# EAGLE design CrackberryPi_1.0.6.2 (EAGLE 7.2.0)
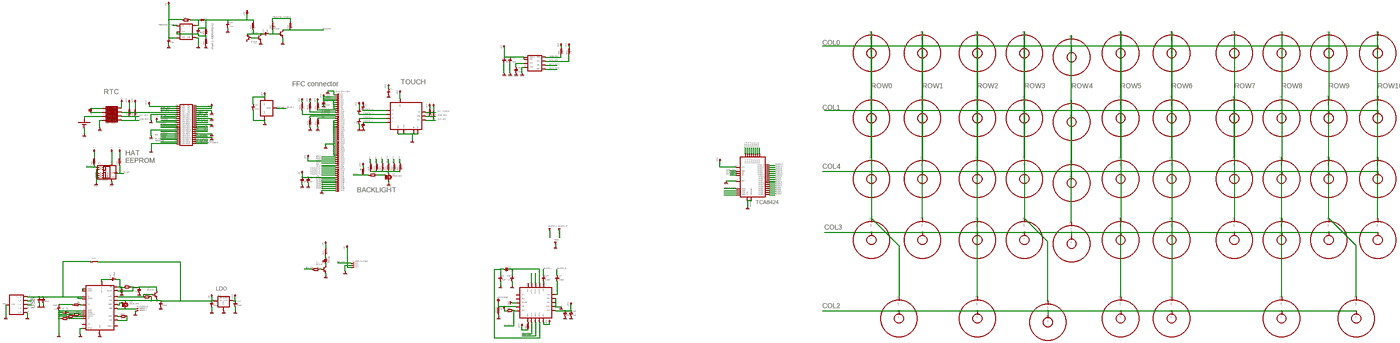
[diagram p0: schematic, sheet 1, overview]
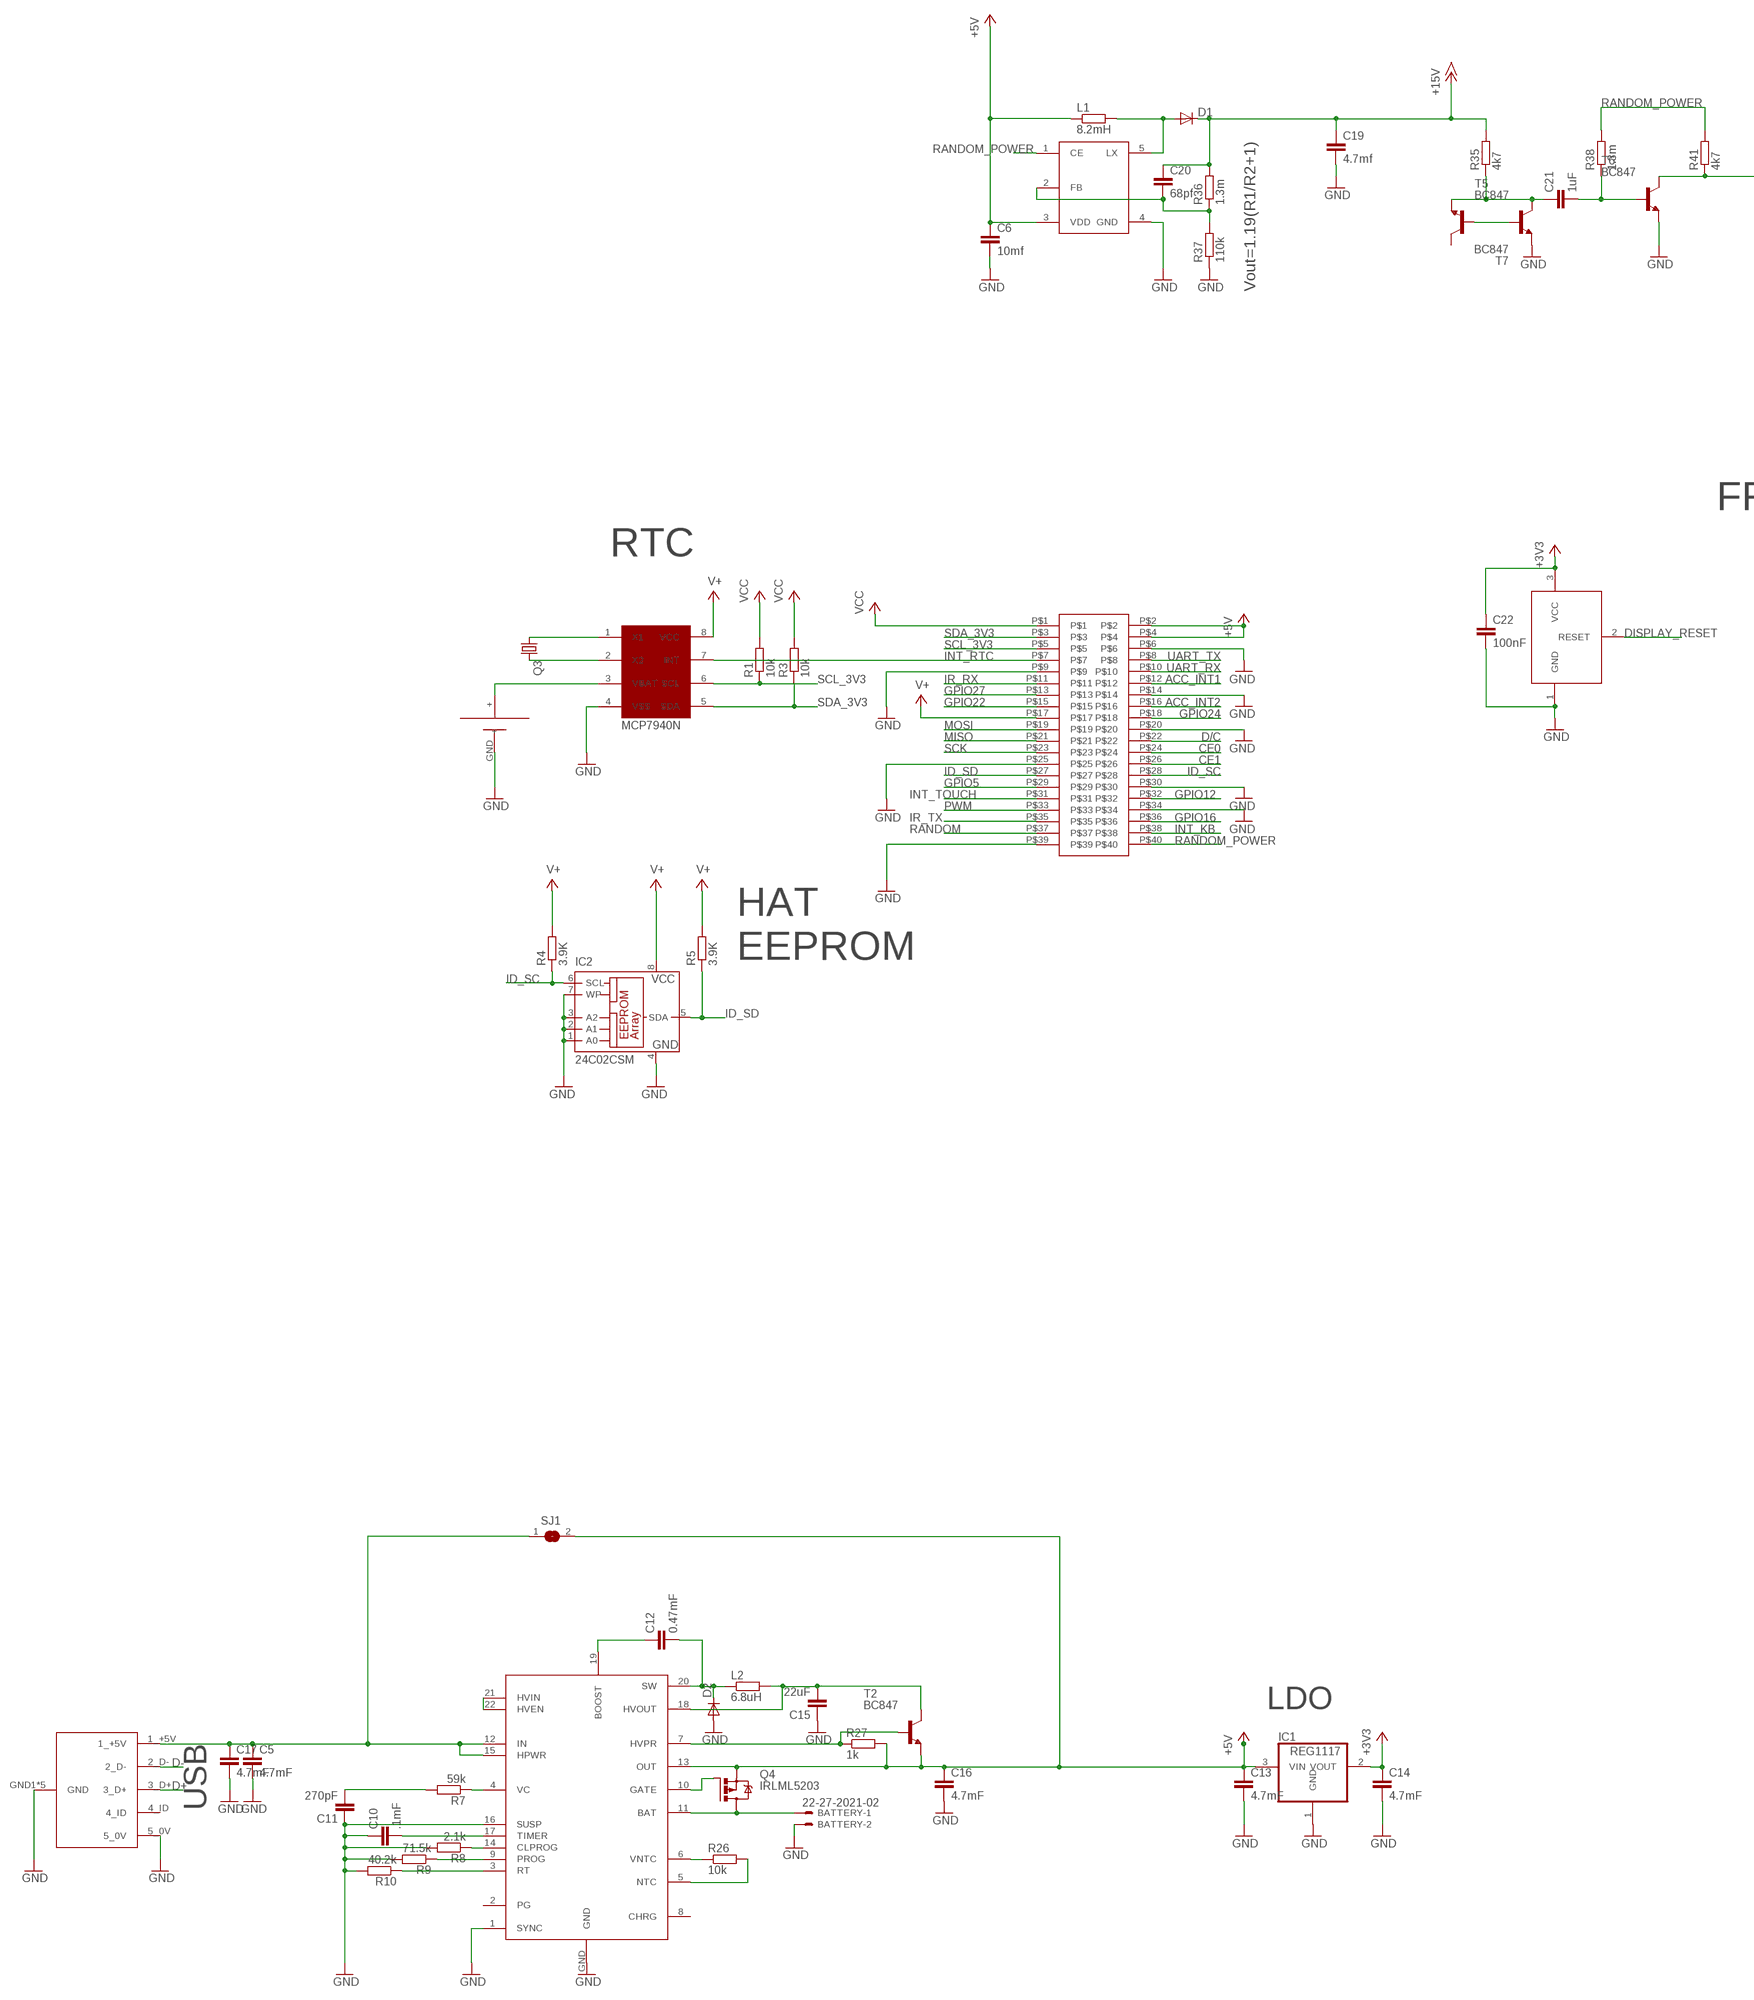
[diagram p1: schematic, sheet 1, part 1 of 4]
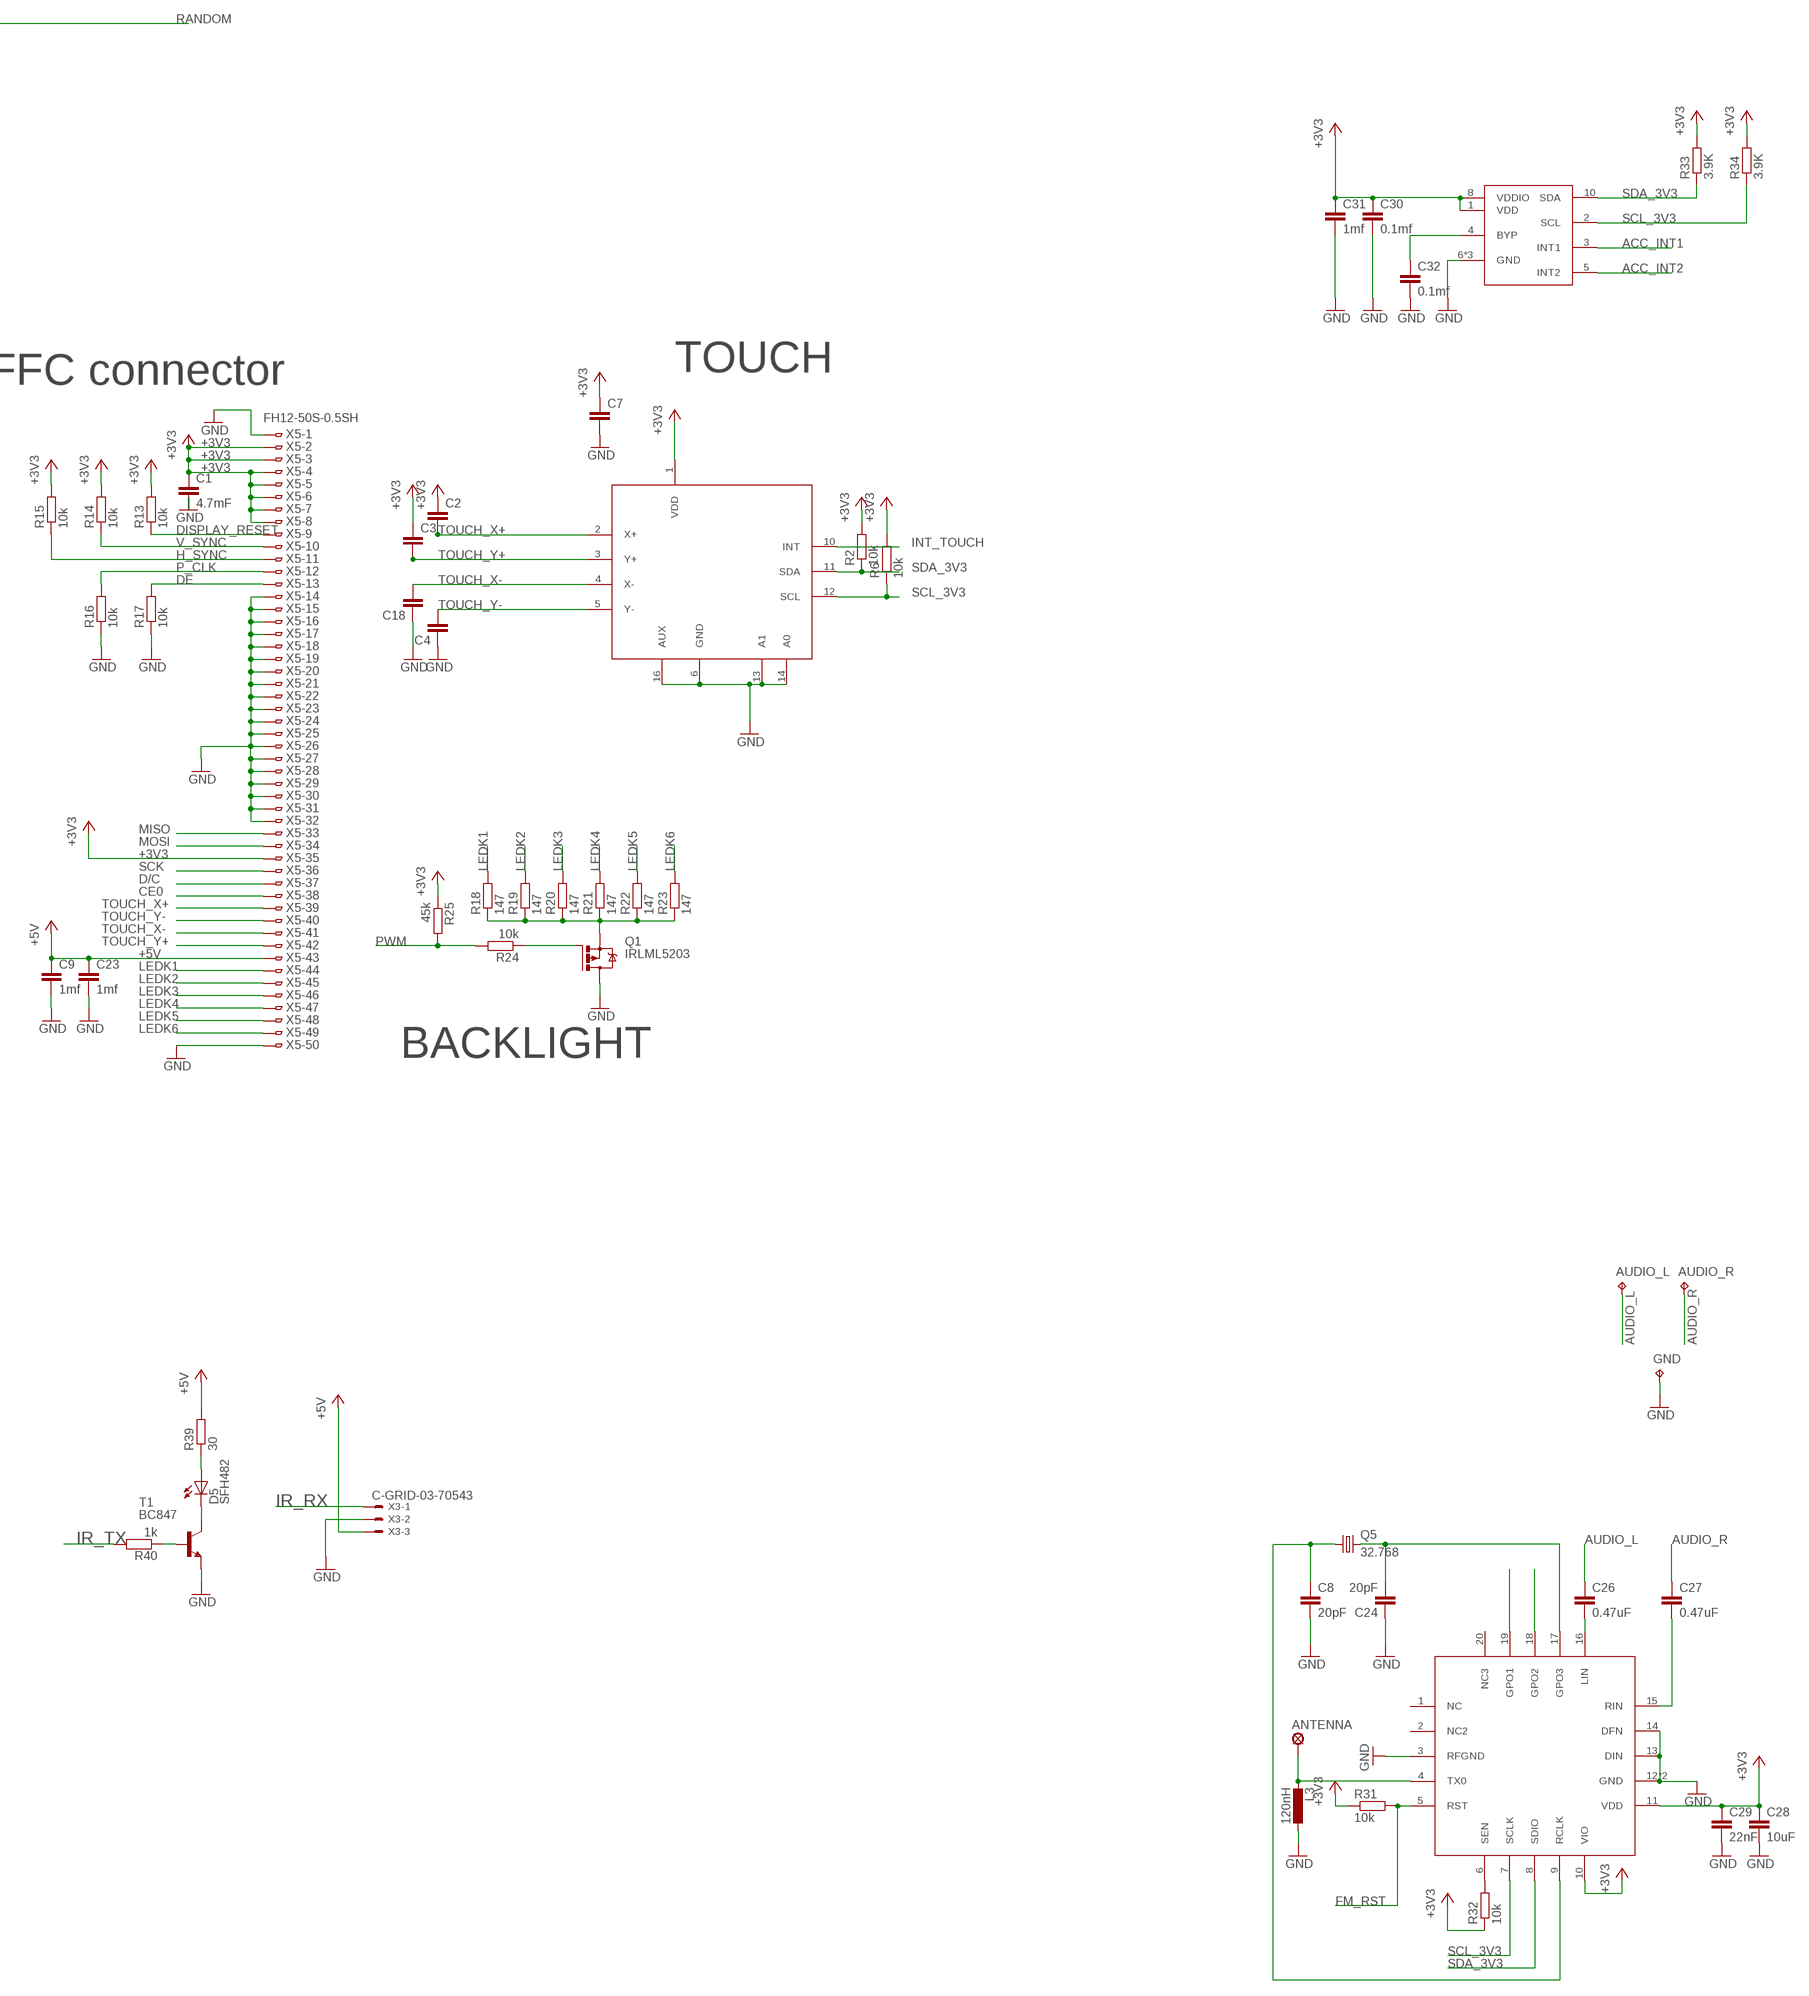
[diagram p2: schematic, sheet 1, part 2 of 4]
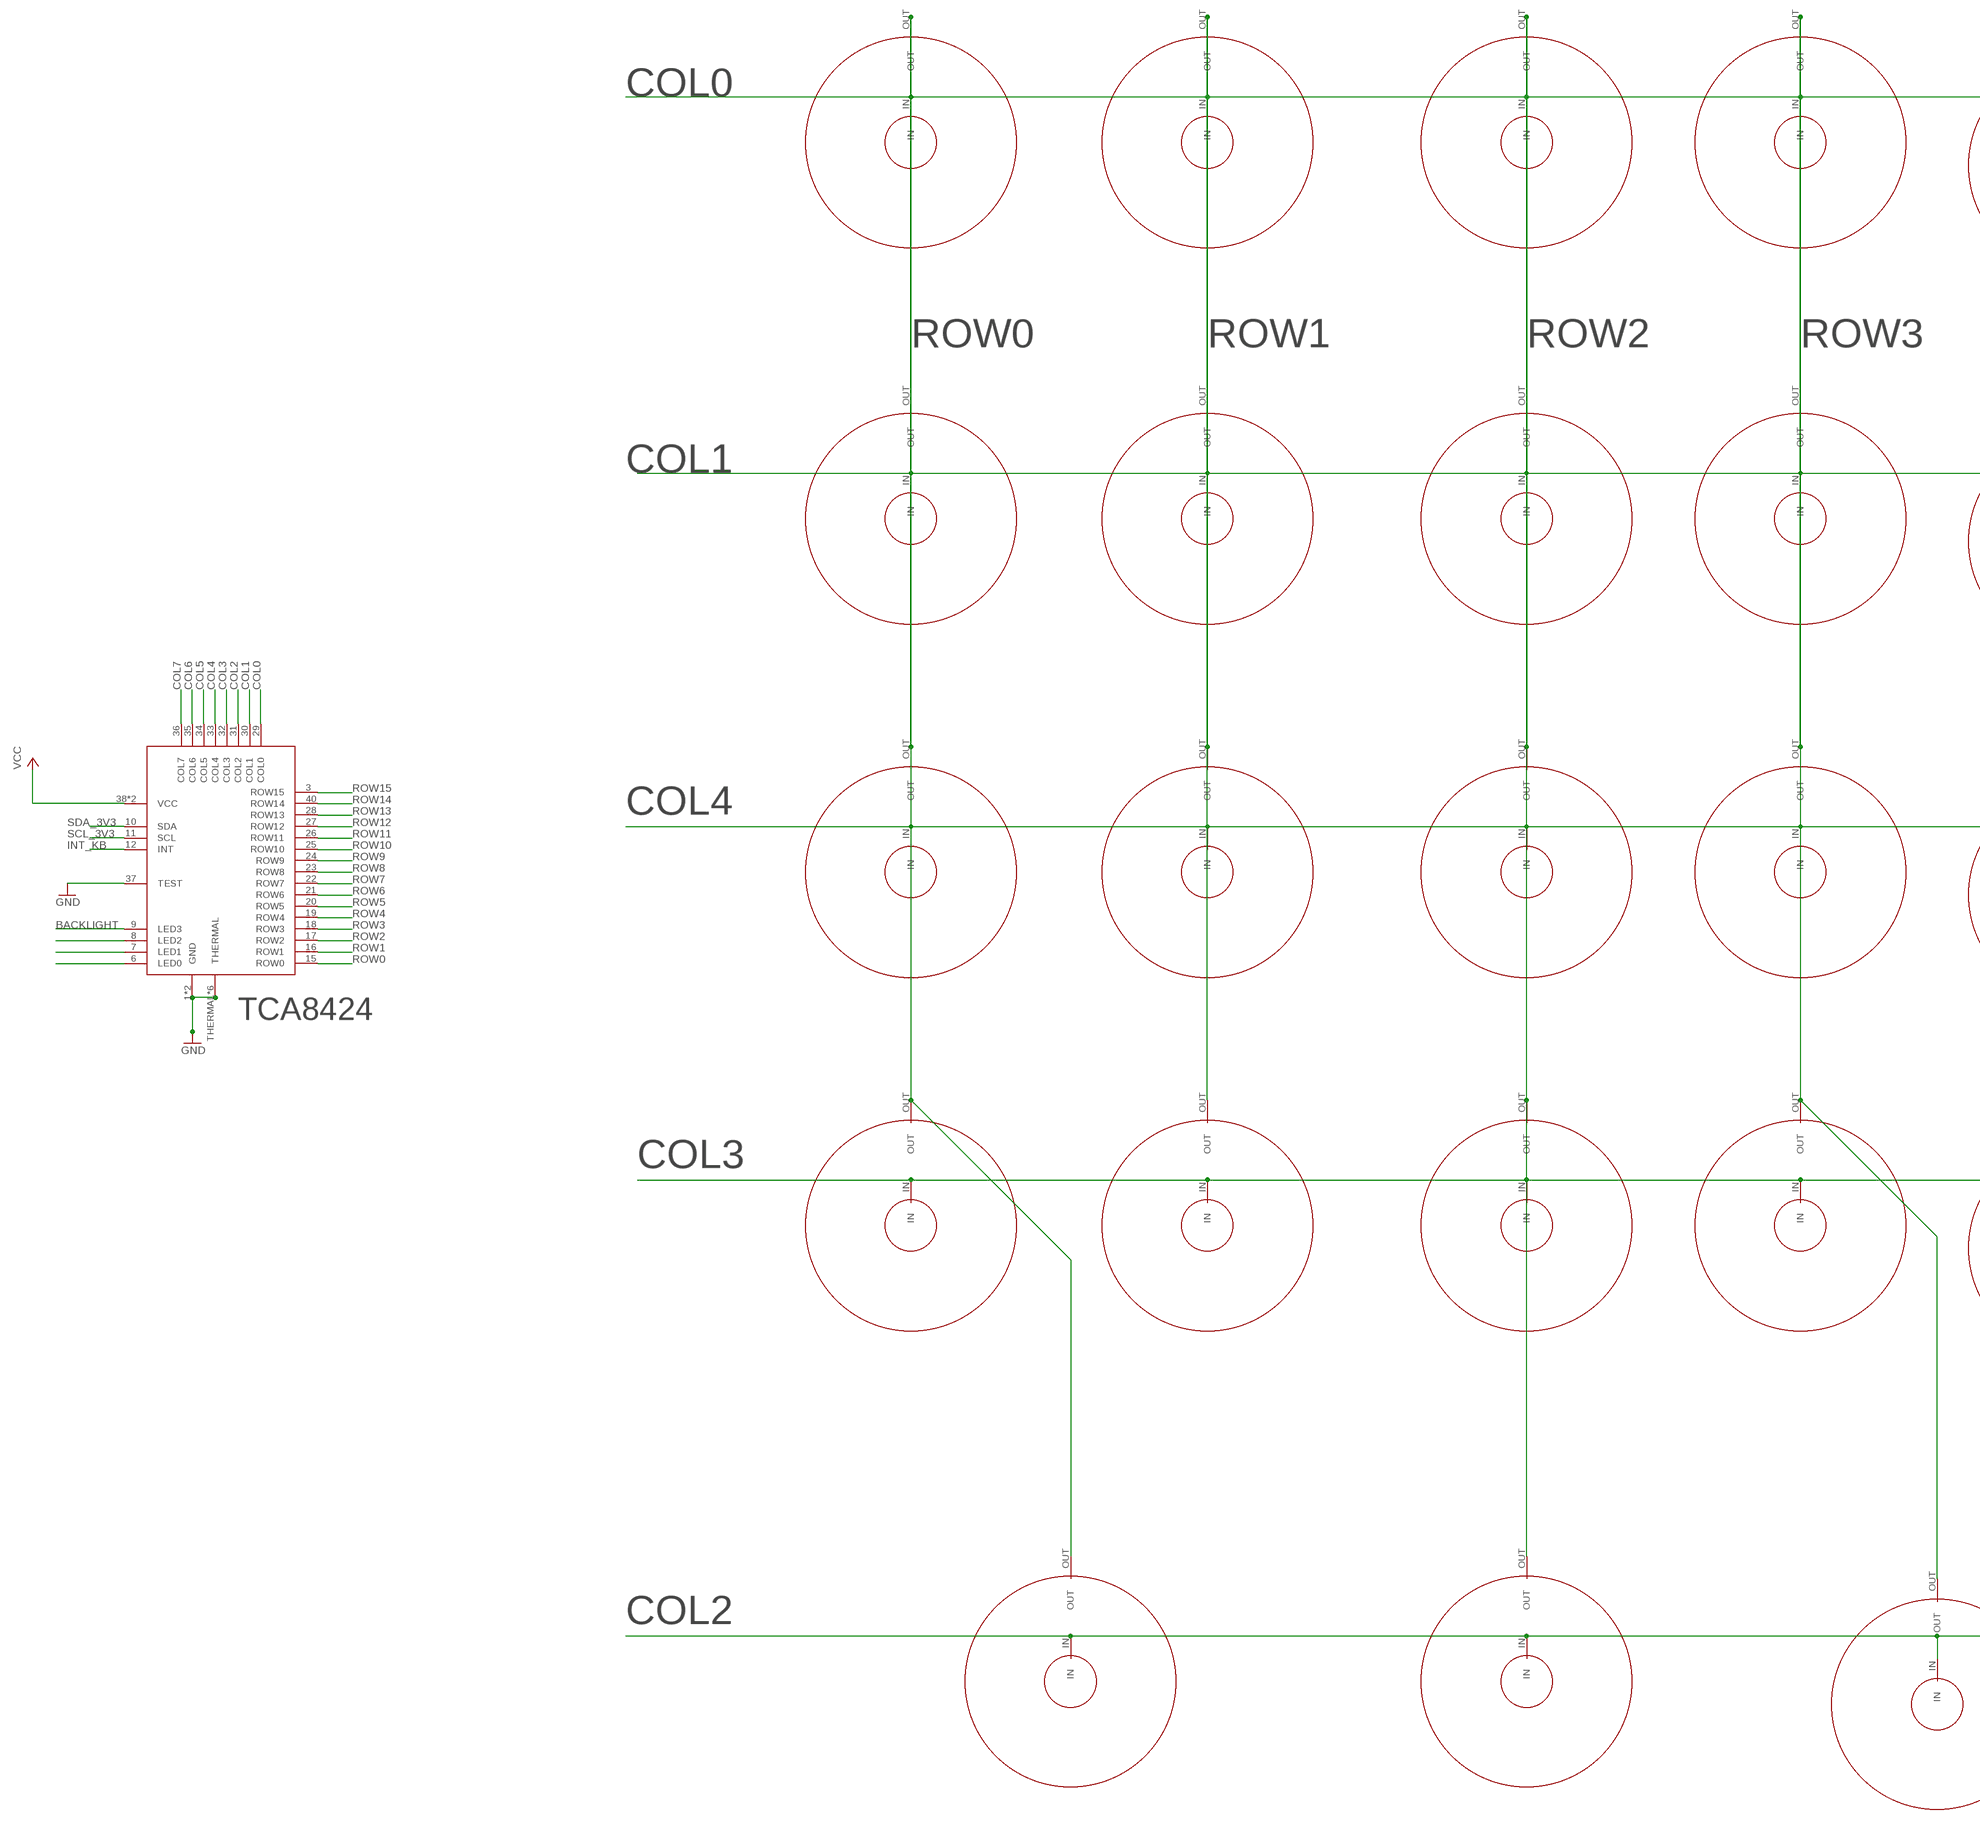
[diagram p3: schematic, sheet 1, part 3 of 4]
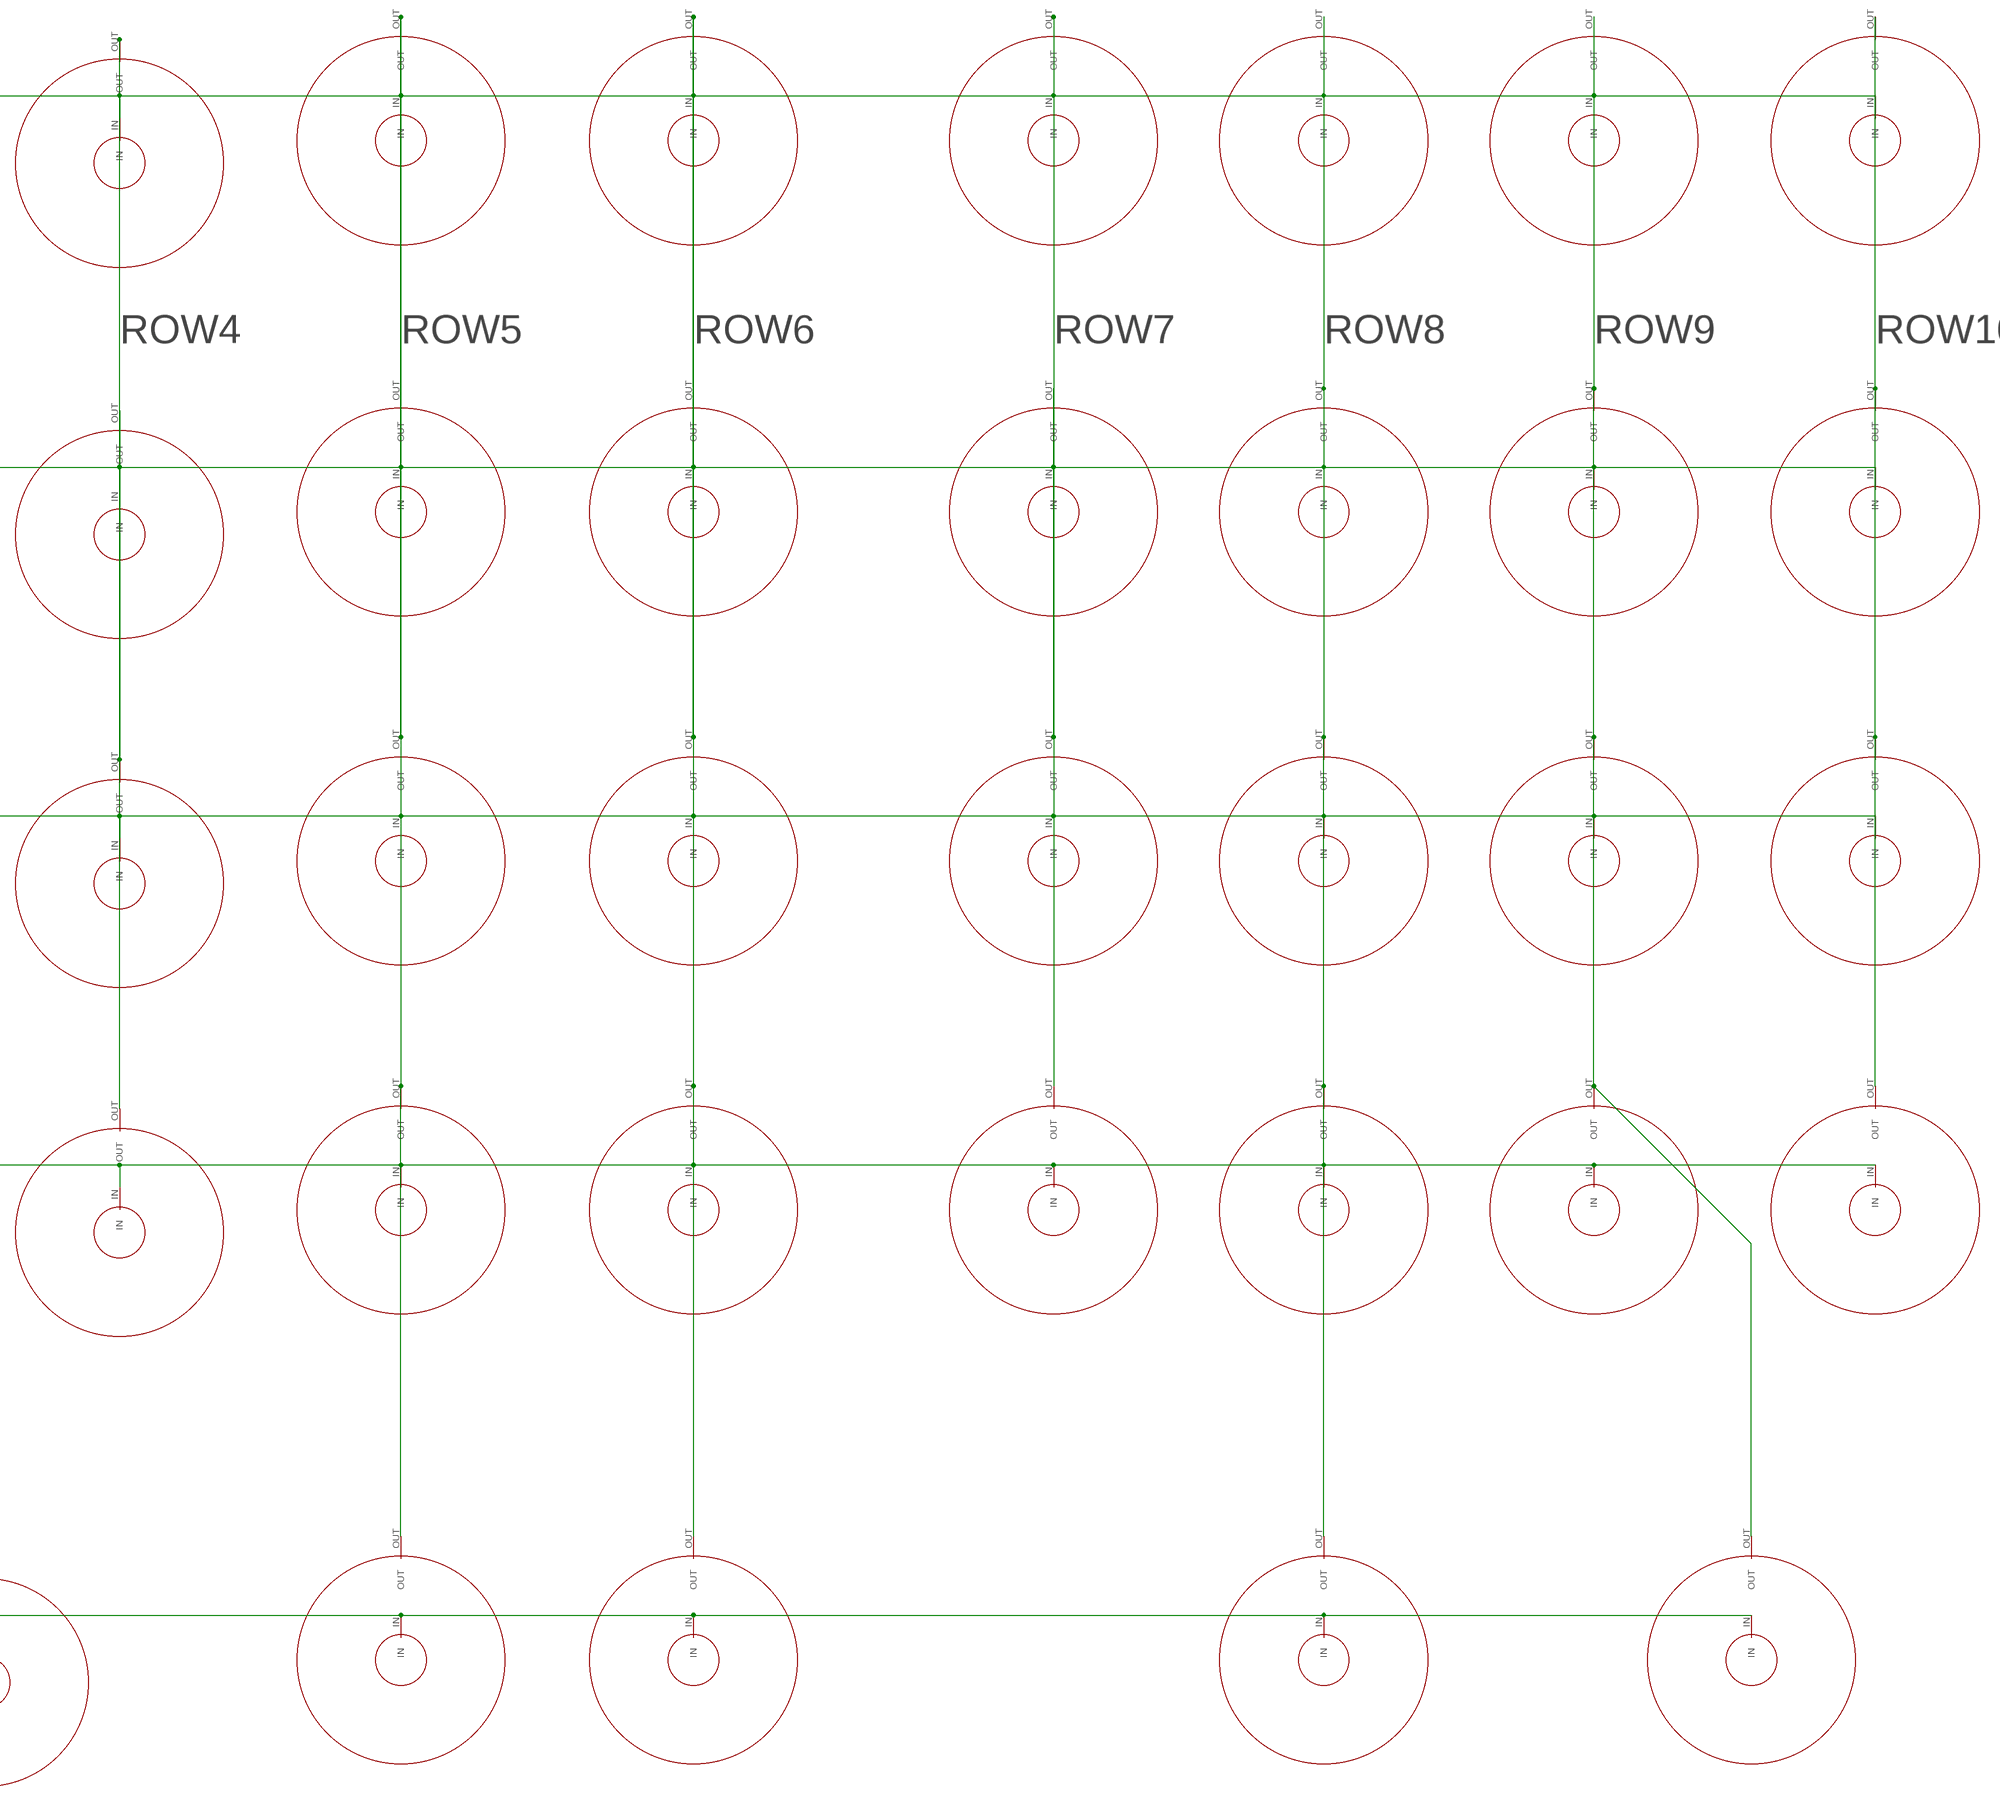
[diagram p4: schematic, sheet 1, part 4 of 4]

## Parts
1  DOME  [4MM]
2  DOME  [4MM]
3  DOME  [4MM]
4  DOME  [4MM]
5  DOME  [4MM]
6  DOME  [4MM]
7  DOME  [4MM]
8  DOME  [4MM]
9  DOME  [4MM]
10  DOME  [4MM]
11  DOME  [4MM]
12  DOME  [4MM]
!  DOME  [4MM]
(  DOME  [4MM]
)  DOME  [4MM]
,  DOME  [4MM]
.  DOME  [4MM]
?  DOME  [4MM]
@  DOME  [4MM]
A  DOME  [4MM]
ANTENNA  LSP10  [LSP10]
AUDIO_L  TPB2,54  [B2,54]
AUDIO_R  TPB2,54  [B2,54]
B  DOME  [4MM]
BATTERY  22-27-2021-02  [6410-02]
C  DOME  [4MM]
C1  4.7mF  C-EUC0603  [C0603]
C2  C-EUC0603  [C0603]
C3  C-EUC0603  [C0603]
C4  C-EUC0603  [C0603]
C5  4.7mF  C-EUC0603  [C0603]
C6  10mf  C-EUC0603  [C0603]
C7  C-EUC0603  [C0603]
C8  20pF  C-EUC0603  [C0603]
C9  1mf  C-EUC0603  [C0603]
C10  .1mF  C-EUC0603  [C0603]
C11  270pF  C-EUC0603  [C0603]
C12  0.47mF  C-EUC0603  [C0603]
C13  4.7mF  C-EUC0603  [C0603]
C14  4.7mF  C-EUC0603  [C0603]
C15  22uF  C-EUC1206  [C1206]
C16  4.7mF  C-EUC0603  [C0603]
C17  4.7mF  C-EUC0603  [C0603]
C18  C-EUC0603  [C0603]
C19  4.7mf  C-EUC0603  [C0603]
C20  68pf  C-EUC0603  [C0603]
C21  1uF  C-EUC0603  [C0603]
C22  100nF  C-EUC0603  [C0603]
C23  1mf  C-EUC0603  [C0603]
C24  20pF  C-EUC0603  [C0603]
C26  0.47uF  C-EUC0603  [C0603]
C27  0.47uF  C-EUC0603  [C0603]
C28  10uF  C-EUC0603  [C0603]
C29  22nF  C-EUC0603  [C0603]
C30  0.1mf  C-EUC0603  [C0603]
C31  1mf  C-EUC0603  [C0603]
C32  0.1mf  C-EUC0603  [C0603]
D  DOME  [4MM]
D1  DIODE-SOD123  [SOD123]
D2  DIODE-SOD123  [SOD123]
D5  SFH482  [SFH482]
E  DOME  [4MM]
F  DOME  [4MM]
FN-RIGHT  DOME  [4MM]
G  DOME  [4MM]
GND  TPB2,54  [B2,54]
H  DOME  [4MM]
I  DOME  [4MM]
IC1  REG1117  [SOT223]
IC2  24C02CSM  [SO-08M]
J  DOME  [4MM]
K  DOME  [4MM]
L  DOME  [4MM]
L1  8.2mH  R-EU_R0805  [R0805]
L2  6.8uH  R-EU_R2010  [R2010]
L3  120nH  L-EUL2012C  [L2012C]
M  DOME  [4MM]
N  DOME  [4MM]
O  DOME  [4MM]
P  DOME  [4MM]
Q  DOME  [4MM]
Q1  IRLML5203  [MICRO3]
Q3  CRYSTALMM20SS  [MM20SS]
Q4  IRLML5203  [MICRO3]
Q5  32.768  CRYSTALMM20SS  [MM20SS]
R  DOME  [4MM]
R1  10k  R-EU_R0603  [R0603]
R2  10k  R-EU_R0603  [R0603]
R3  10k  R-EU_R0603  [R0603]
R4  3.9K  R-EU_R0603  [R0603]
R5  3.9K  R-EU_R0603  [R0603]
R6  10k  R-EU_R0603  [R0603]
R7  59k  R-EU_R0603  [R0603]
R8  2.1k  R-EU_R0603  [R0603]
R9  71.5k  R-EU_R0603  [R0603]
R10  40.2k  R-EU_R0603  [R0603]
R13  10k  R-EU_R0603  [R0603]
R14  10k  R-EU_R0603  [R0603]
R15  10k  R-EU_R0603  [R0603]
R16  10k  R-EU_R0603  [R0603]
R17  10k  R-EU_R0603  [R0603]
R18  147  R-EU_R0603  [R0603]
R19  147  R-EU_R0603  [R0603]
R20  147  R-EU_R0603  [R0603]
R21  147  R-EU_R0603  [R0603]
R22  147  R-EU_R0603  [R0603]
R23  147  R-EU_R0603  [R0603]
R24  10k  R-EU_R0603  [R0603]
R25  45k  R-EU_R0603  [R0603]
R26  10k  R-EU_R0603  [R0603]
R27  1k  R-EU_R0603  [R0603]
R31  10k  R-EU_R0603  [R0603]
R32  10k  R-EU_R0603  [R0603]
R33  3.9K  R-EU_R0603  [R0603]
R34  3.9K  R-EU_R0603  [R0603]
R35  4k7  R-EU_R0603  [R0603]
R36  1.3m  R-EU_R0603  [R0603]
R37  110k  R-EU_R0603  [R0603]
R38  1.3m  R-EU_R0603  [R0603]
R39  30  R-EU_R0603  [R0603]
R40  1k  R-EU_R0603  [R0603]
R41  4k7  R-EU_R0603  [R0603]
S  DOME  [4MM]
SHIFT-RIGHT  DOME  [4MM]
SHILFT-LEFT  DOME  [4MM]
SJ1  SJ  [SJ]
SPACE1  DOME  [4MM]
SPACE2  DOME  [4MM]
SPACE3  DOME  [4MM]
T  DOME  [4MM]
T1  BC847  [SOT23]
T2  BC847  [SOT23]
T5  BC847  [SOT23]
T6  BC847  [SOT23]
T7  BC847  [SOT23]
U  DOME  [4MM]
U$1  LTC4090  [DFN22]
U$2  NCP1406  [SOT23-5L]
U$3  RESETMONITOR  [SOT23]
U$4  CR1216  [CR1216]
U$5  MCP7940N  [SO08]
U$6  TSC2007  [TSSOP16]
U$7  TCA8424  [QFN40]
U$9  MICRO_USB  [MICRO_USB]
U$11  HEADER  [20X2]
U$12  SI4713  [QFN20-3X3]
U$13  ACCELLEROMETER  [DFN-10_2X2]
V  DOME  [4MM]
W  DOME  [4MM]
X  DOME  [4MM]
X3  C-GRID-03-70543  [70543-03]
X5  FH12-50S-0.5SH  [FH12-50S-0.5SH]
Y  DOME  [4MM]
Z  DOME  [4MM]

## Nets
+3V3: C1.1 C2.1 C3.1 C7.1 C14.1 C22.1 C28.1 C29.1 C30.1 C31.1 IC1.2(VOUT) R2.2 R6.2 R13.2 R14.2 R15.2 R25.1 R31.1 R32.1 R33.2 R34.2 U$3.3(VCC) U$6.1(VDD) U$12.10(VIO) U$12.11(VDD) U$13.1(VDD) U$13.8(VDDIO) X5.2 X5.3 X5.4 X5.5 X5.6 X5.7 X5.8 X5.35
+5V: C6.1 C9.1 C13.1 C16.1 C23.1 IC1.3(VIN) L1.1 Q4.2(S) R27.2 R39.2 SJ1.2 T2.2(E) U$1.13(OUT) U$2.3(VDD) U$11.P$2 U$11.P$4 X3.3 X5.43
+15V: C19.1 C20.1 D1.C R35.2 R36.2
ACC_INT1: U$11.P$12 U$13.3(INT1)
ACC_INT2: U$11.P$16 U$13.5(INT2)
AUDIO_L: AUDIO_L.TP C26.1
AUDIO_R: AUDIO_R.TP C27.1
BACKLIGHT: U$7.9(LED3)
BASE: R40.1 T1.1(B)
BAT: BATTERY.1 Q4.3(D) U$1.11(BAT)
BOOST: C12.1 U$1.19(BOOST)
CE0: U$11.P$24 X5.38
CE1: U$11.P$26
COL0: 1.IN 2.IN 3.IN 4.IN 5.IN 6.IN 7.IN 8.IN 9.IN 10.IN 11.IN U$7.29(COL0)
COL1: 12.IN E.IN I.IN O.IN P.IN Q.IN R.IN T.IN U$7.30(COL1) U.IN W.IN Y.IN
COL2: @.IN FN-RIGHT.IN SHIFT-RIGHT.IN SHILFT-LEFT.IN SPACE1.IN SPACE2.IN SPACE3.IN U$7.31(COL2)
COL3: !.IN ,.IN ..IN ?.IN B.IN C.IN M.IN N.IN U$7.32(COL3) V.IN X.IN Z.IN
COL4: (.IN ).IN A.IN D.IN F.IN G.IN H.IN J.IN K.IN L.IN S.IN U$7.33(COL4)
COL5: U$7.34(COL5)
COL6: U$7.35(COL6)
COL7: U$7.36(COL7)
COLLECTOR: D5.K(C) T1.3(C)
D+: U$9.3_D+
D-: U$9.2_D-
D/C: U$11.P$22 X5.37
DE: R17.2 X5.13
DISPLAY_RESET: R13.1 U$3.2(RESET) X5.9
FB: C20.2 R36.1 R37.2 U$2.2(FB)
FM_RST: R31.2 U$12.5(RST)
GND: BATTERY.2 C1.2 C4.1 C5.2 C6.2 C7.2 C8.2 C9.2 C10.1 C11.1 C13.2 C14.2 C15.1 C16.2 C17.2 C18.1 C19.2 C22.2 C23.2 C24.1 C28.2 C29.2 C30.2 C31.2 C32.2 D2.A GND.TP IC1.1(GND) IC2.1(A0) IC2.2(A1) IC2.3(A2) IC2.4(GND) IC2.7(WP) L3.1 Q1.3(D) R8.2 R9.2 R10.2 R16.1 R17.1 R37.1 T1.2(E) T5.2(E) T6.2(E) U$1.1(SYNC) U$1.16(SUSP) U$1.GND U$2.4(GND) U$3.1(GND) U$4.GND(-) U$5.4(VSS) U$6.6(GND) U$6.13(A1) U$6.14(A0) U$6.16(AUX) U$7.1(GND) U$7.4(GND) U$7.37(TEST) U$7.THERMAL U$7.VIA1(THERMAL) U$7.VIA2(THERMAL) U$7.VIA3(THERMAL) U$7.VIA4(THERMAL) U$7.VIA5(THERMAL) U$9.5_0V U$9.GND1(GND) U$9.GND2(GND) U$9.GND5(GND) U$9.P$1(GND) U$9.P$7(GND) U$11.P$6 U$11.P$9 U$11.P$14 U$11.P$20 U$11.P$25 U$11.P$30 U$11.P$34 U$11.P$39 U$12.3(RFGND) U$12.12(GND) U$12.13(DIN) U$12.14(DFN) U$12.P$1(GND) U$13.6(GND) U$13.7(GND) U$13.9(GND) X3.2 X5.1 X5.14 X5.15 X5.16 X5.17 X5.18 X5.19 X5.20 X5.21 X5.22 X5.23 X5.24 X5.25 X5.26 X5.27 X5.28 X5.29 X5.30 X5.31 X5.32 X5.50
GPIO5: U$11.P$29
GPIO12: U$11.P$32
GPIO16: U$11.P$36
GPIO22: U$11.P$15
GPIO24: U$11.P$18
GPIO27: U$11.P$13
GPO1: U$12.19(GPO1)
GPO2: U$12.18(GPO2)
H_SYNC: R15.1 X5.11
HVOUT: C15.2 L2.2 T2.3(C) U$1.18(HVOUT)
HVPR: R27.1 T2.1(B) U$1.7(HVPR)
ID_SC: IC2.6(SCL) R4.1 U$11.P$28
ID_SD: IC2.5(SDA) R5.1 U$11.P$27
IN: C5.1 C17.1 SJ1.1 U$1.12(IN) U$1.15(HPWR) U$9.1_+5V
INT_KB: U$7.12(INT) U$11.P$38
INT_RTC: U$5.7(INT) U$11.P$7
INT_TOUCH: U$6.10(INT) U$11.P$31
IR_RX: U$11.P$11 X3.1
IR_TX: R40.2 U$11.P$35
LEDK1: R18.2 X5.44
LEDK2: R19.2 X5.45
LEDK3: R20.2 X5.46
LEDK4: R21.2 X5.47
LEDK5: R22.2 X5.48
LEDK6: R23.2 X5.49
LX: D1.A L1.2 U$2.5(LX)
MISO: U$11.P$21 X5.33
MOSI: U$11.P$19 X5.34
N$1: Q3.4 U$5.2(X2)
N$2: Q3.1 U$5.1(X1)
N$3: R9.1 U$1.9(PROG)
N$4: R10.1 U$1.3(RT)
N$5: R8.1 U$1.14(CLPROG)
N$6: R7.1 U$1.4(VC)
N$7: C10.2 U$1.17(TIMER)
N$8: C11.2 R7.2
N$9: U$1.21(HVIN) U$1.22(HVEN)
N$10: U$7.6(LED0)
N$12: Q1.2(S) R18.1 R19.1 R20.1 R21.1 R22.1 R23.1
N$14: U$7.7(LED1)
N$15: C8.1 Q5.1 U$12.9(RCLK)
N$16: T5.1(B) T7.1(B)
N$18: U$7.8(LED2)
N$19: C24.2 Q5.4 U$12.17(GPO3)
N$20: Q1.1(G) R24.1
N$21: R26.1 U$1.6(VNTC)
N$23: C26.2 U$12.16(LIN)
N$25: C27.2 U$12.15(RIN)
N$26: ANTENNA.MP L3.2 U$12.4(TX0)
N$27: R26.2 U$1.5(NTC)
N$28: C21.1 R35.1 T5.3(C) T7.2(E)
N$29: R32.2 U$12.6(SEN)
N$30: D5.A R39.1
N$31: C32.1 U$13.4(BYP)
N$32: C21.2 R38.1 T6.1(B)
N$33: Q4.1(G) U$1.10(GATE)
P_CLK: R16.2 X5.12
PWM: R24.2 R25.2 U$11.P$33
RANDOM: R41.1 T6.3(C) U$11.P$37
RANDOM_POWER: R38.2 R41.2 U$2.1(CE) U$11.P$40
ROW0: 1.OUT A.OUT Q.OUT SHILFT-LEFT.OUT U$7.15(ROW0) Z.OUT
ROW1: 2.OUT S.OUT U$7.16(ROW1) W.OUT X.OUT
ROW2: 3.OUT C.OUT D.OUT E.OUT SPACE1.OUT U$7.17(ROW2)
ROW3: 4.OUT F.OUT R.OUT SPACE2.OUT U$7.18(ROW3) V.OUT
ROW4: 5.OUT B.OUT G.OUT T.OUT U$7.19(ROW4)
ROW5: 6.OUT H.OUT N.OUT SPACE3.OUT U$7.20(ROW5) Y.OUT
ROW6: 7.OUT J.OUT M.OUT SHIFT-RIGHT.OUT U$7.21(ROW6) U.OUT
ROW7: 8.OUT ?.OUT I.OUT K.OUT U$7.22(ROW7)
ROW8: 9.OUT !.OUT @.OUT L.OUT O.OUT U$7.23(ROW8)
ROW9: 10.OUT (.OUT ,.OUT FN-RIGHT.OUT P.OUT U$7.24(ROW9)
ROW10: 11.OUT 12.OUT ).OUT ..OUT U$7.25(ROW10)
ROW11: U$7.26(ROW11)
ROW12: U$7.27(ROW12)
ROW13: U$7.28(ROW13)
ROW14: U$7.40(ROW14)
ROW15: U$7.3(ROW15)
SCK: U$11.P$23 X5.36
SCL_3V3: R1.1 R6.1 R34.1 U$5.6(SCL) U$6.12(SCL) U$7.11(SCL) U$11.P$5 U$12.7(SCLK) U$13.2(SCL)
SDA_3V3: R2.1 R3.1 R33.1 U$5.5(SDA) U$6.11(SDA) U$7.10(SDA) U$11.P$3 U$12.8(SDIO) U$13.10(SDA)
SW: C12.2 D2.C L2.1 U$1.20(SW)
TOUCH_X+: C2.2 U$6.2(X+) X5.39
TOUCH_X-: C18.2 U$6.4(X-) X5.41
TOUCH_Y+: C3.2 U$6.3(Y+) X5.42
TOUCH_Y-: C4.2 U$6.5(Y-) X5.40
UART_RX: U$11.P$10
UART_TX: U$11.P$8
V+: IC2.8(VCC) R4.2 R5.2 U$5.8(VCC) U$11.P$17
V_SYNC: R14.1 X5.10
VBAT+: U$4.+ U$5.3(VBAT)
VCC: R1.2 R3.2 U$7.38(VCC) U$7.39(VCC) U$11.P$1
Unconnected: T7.3(C) U$1.2(PG) U$1.8(CHRG) U$9.4_ID U$12.1(NC) U$12.2(NC2) U$12.20(NC3)

## Notes on the sheet
- Vout=1.19(R1/R2+1)
- FFC connector | TOUCH
- RTC
- MCP7940N
- HAT
  EEPROM
- BACKLIGHT
- TCA8424
- LDO
- USB

## Library data of the parts
1-12 ! ( ) , . ? @ A B C D E F FN-RIGHT G H I J K L M N O P Q R S SHIFT-RIGHT SHILFT-LEFT SPACE1-SPACE3 T U V W X Y Z = DOME:DOME
ANTENNA = solpad:LSP10: SOLDER PAD drill 1.0 mm, distributor Buerklin, 12H555
AUDIO_L AUDIO_R GND = testpad:TP: Test pad
BATTERY = con-molex:22-?-02: CONNECTOR wire to board 2.54 mm (.1 inch) pitch header; OC_FARNELL: unknown; OC_NEWARK: unknown
C1-C24 C26-C32 = rcl:C-EU: CAPACITOR, European symbol
D1 D2 = diode:DIODE-: DIODE
D5 = led:SFH482: IR LED infrared emitting diode, Infineon
IC1 = burr-brown:REG1117: 800mA and 1A Low Dropout (LDO) Positive Regulator 1.8V, 2.5V, 2.85V, 3.3V, 5V, and Adj; MPN: REG1117; OC_FARNELL: 1097566; OC_NEWARK: 14P6981
IC2 = microchip:24C*: Serial EEPROM 1 K/2 K/4 K; MF: MICROCHIP; MPN: 24C02C-I/SN; OC_FARNELL: 1084339; OC_NEWARK: 96K4063
L1 L2 R1-R10 R13-R27 R31-R41 = rcl:R-EU_: RESISTOR, European symbol
L3 = rcl:L-EU: INDUCTOR, European symbol
Q1 Q4 = transistor-power:IRLML5203: HEXFET P-Channel Power MOSFET
Q3 Q5 = crystal:CRYSTAL: CRYSTAL; OC_FARNELL: unknown; OC_NEWARK: unknown
SJ1 = jumper:SJ: SMD solder JUMPER
T1 T2 T5-T7 = transistor:BC847: NPN TRANSISTOR
U$1 = LTC4090:LTC4090
U$2 = ncp1406:NCP1406
U$3 = MAX803:RESETMONITOR
U$4 = cr1216:CR1216
U$5 = MCP7940N:MCP7940N
U$6 = tsc2046:TSC2007
U$7 = TCA8424:TCA8424
U$9 = MICRO_USB:MICRO_USB
U$11 = 20x2_cirqoid:HEADER
U$12 = Si4713:SI4713
U$13 = MMA8653:ACCELLEROMETER
X3 = con-molex:C-GRID-03: CONNECTOR wire to board 2.54 mm (0.100") pitch header; OC_FARNELL: unknown; OC_NEWARK: unknown
X5 = FCI_62684:FH12-50S-0.5S: 0.5mm Pitch Connectors For FPC/FFC Source: Data sheet <http://www.hirose.co.jp/cataloge_hp/e58605370.pdf>; MPN: FH12-50S-0.5SH(55); OC_FARNELL: 1324557; OC_NEWARK: 34M6181

## Board
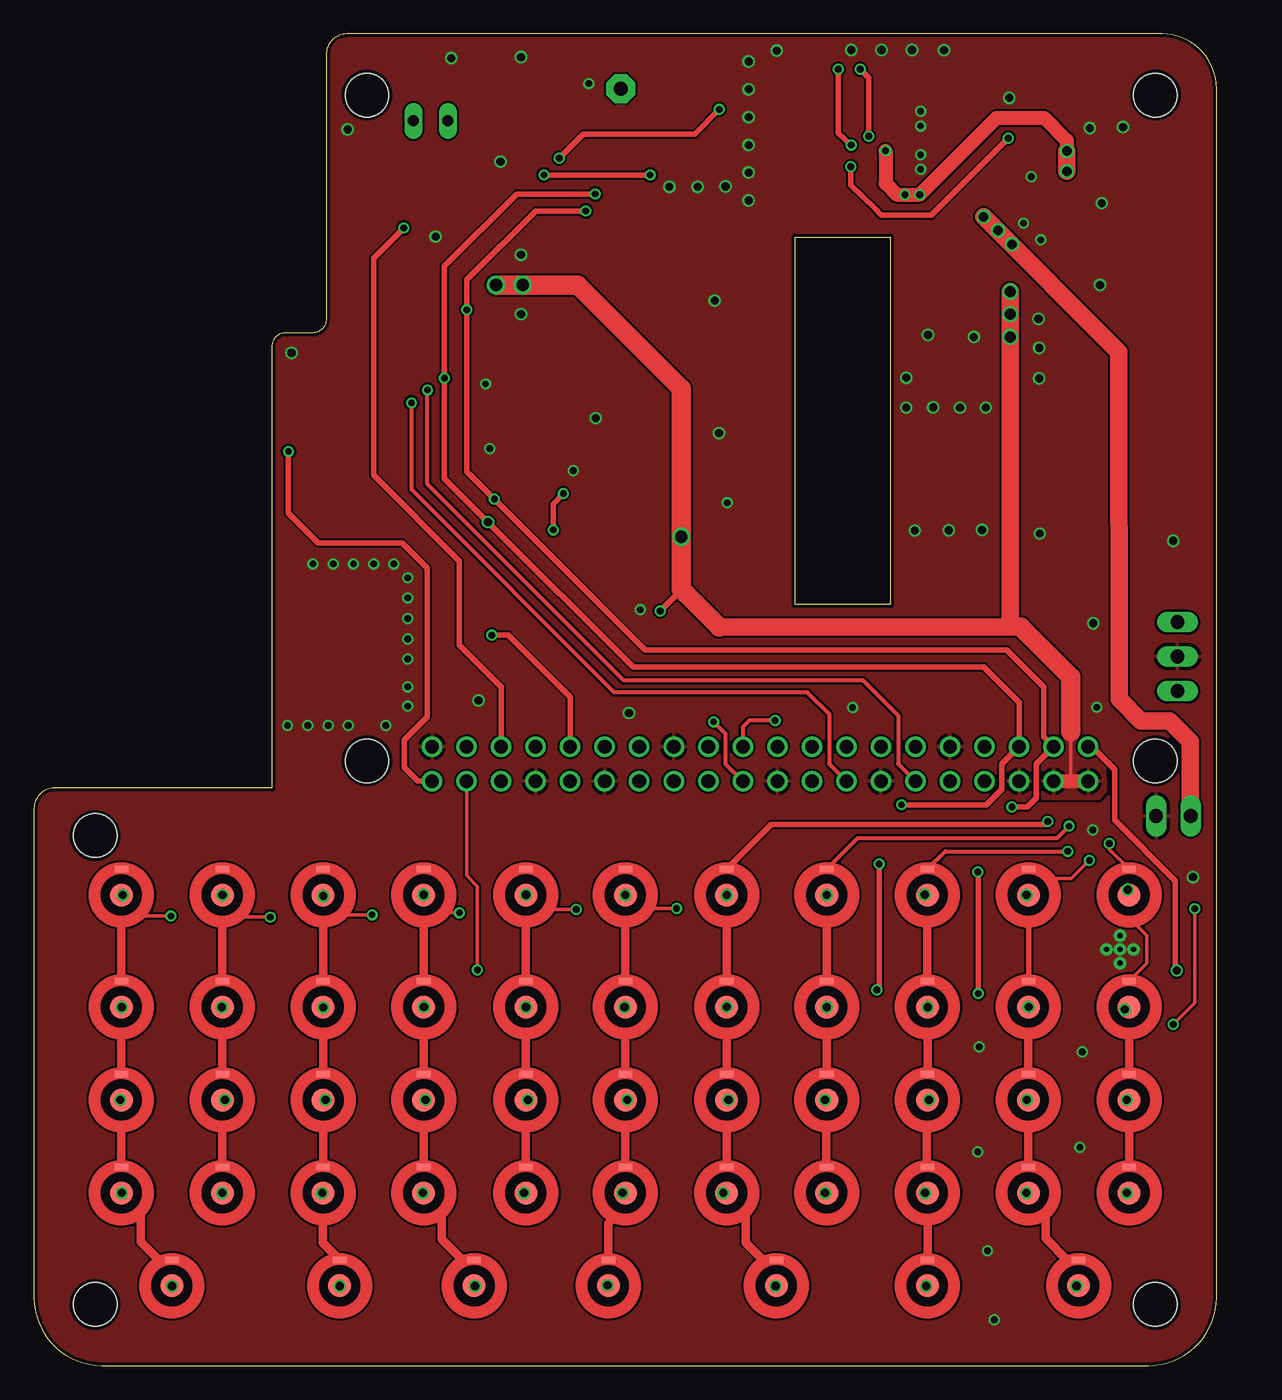
[diagram p5: board, top side]
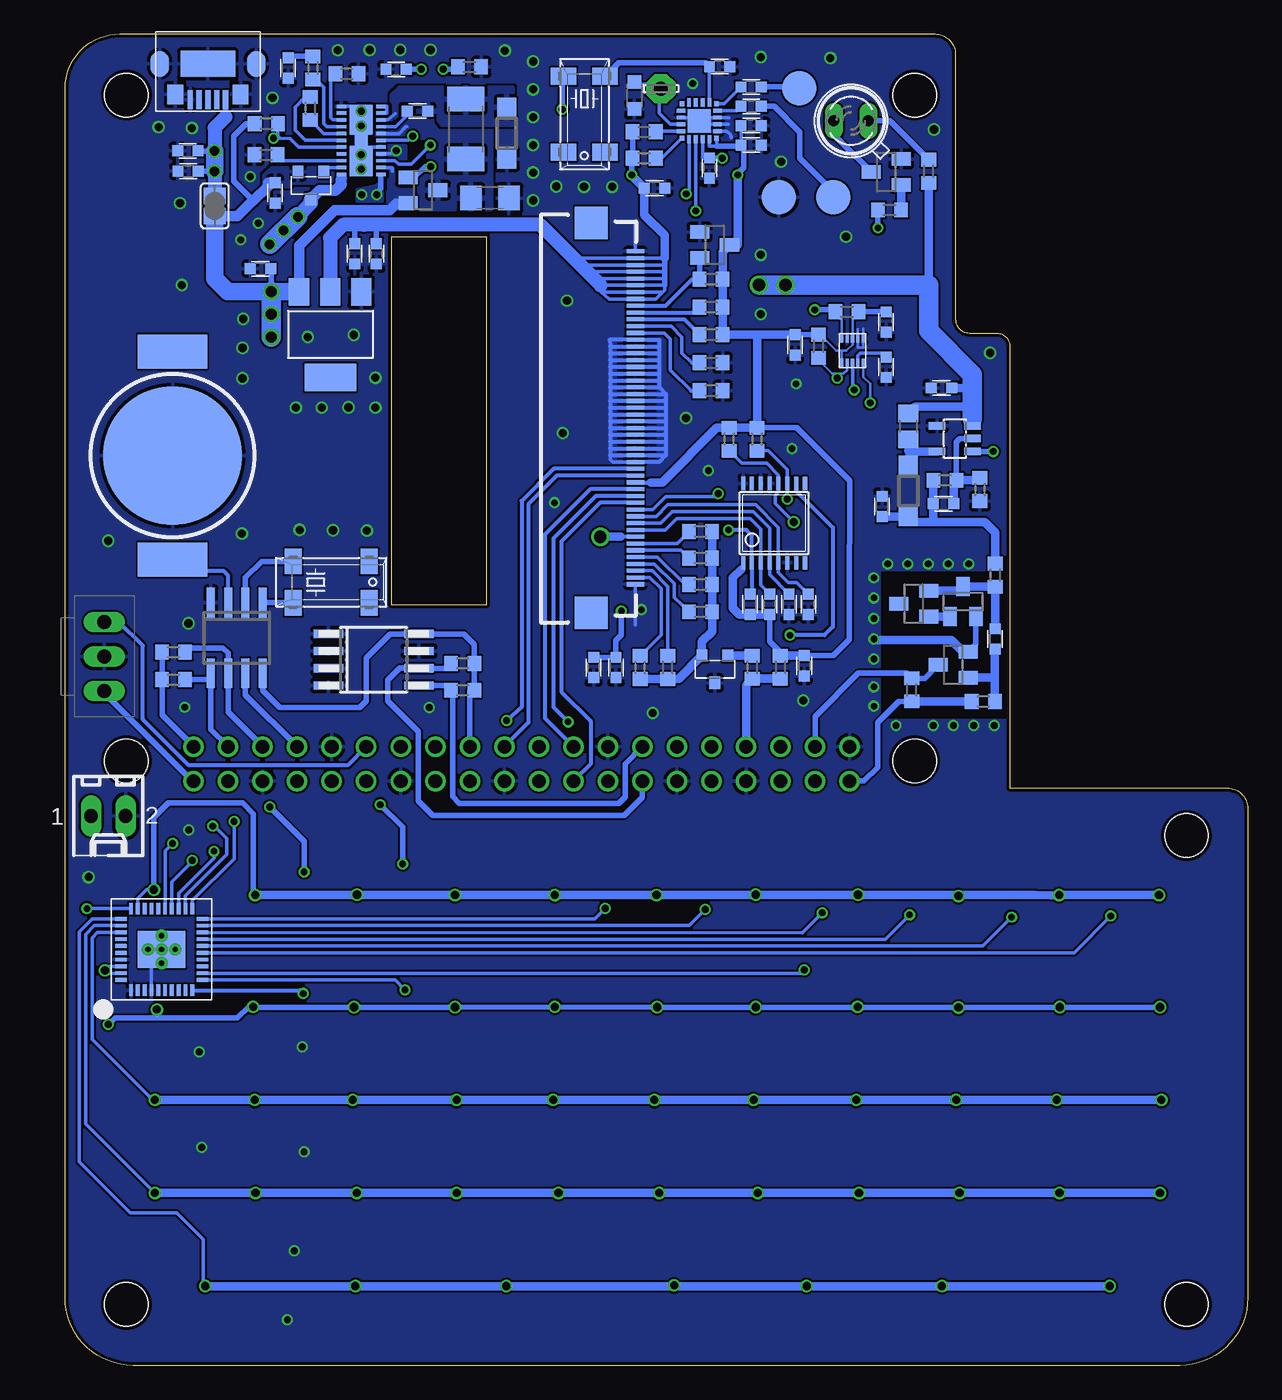
[diagram p6: board, bottom side, seen from below]

Size 87 x 98 mm. Coordinates in mm from the lower left corner, seen from the top.
Outline: 17.5,42.5 1.5,42.5 arc90 0,41 0,5 arc90 5,0 82,0 arc90 87,5 87,94 arc90 83,98 23,98 arc90 21.5,96.5 21.5,77 arc-90 20.5,76 18.5,76 arc90 17.5,75 17.5,42.5
Outline: 63,56 56,56 56,83.05 63,83.05 63,56
Copper layers (1*16): Top 0.035mm / dielectric 1.5mm / Bottom 0.035mm
Design rules "SeeedStudio_2layer_DRU_no_angle_20140221": minimum track width 6mil, minimum drill 12mil, track to track 6mil, track to pad 6mil, pad to pad 6mil, via to via 6mil, smd to smd 0mil, copper to edge 10mil, drill to drill 10mil, minimum pad ring 10mil, minimum via ring 6mil, stop-mask expansion 2mil, vias tented up to drill 100mil, thermal gap 10mil
Holes 3.2 mm at 82.5,93.5 24.5,93.5 82.5,44.5 24.5,44.5 4.5,4.5 4.5,39 82.5,4.5
tRestrict: area 56,56 to 63,83.1
bRestrict: area 43.5,74.2 to 46.4,74.3; area 43.5,73.7 to 46.4,73.8; area 43.5,73.2 to 46.4,73.3; area 43.5,72.7 to 46.4,72.8; area 43.5,72.2 to 46.4,72.3; area 43.5,71.7 to 46.4,71.8; area 43.5,71.2 to 46.4,71.3; area 43.5,70.7 to 46.4,70.8; area 43.5,70.2 to 46.4,70.3; area 43.5,69.7 to 46.4,69.8; area 43.5,69.2 to 46.4,69.3; area 43.5,68.7 to 46.4,68.8; 17 more areas

### Footprints (pad centres in the part's own frame; a part is rotated, then mirrored left to right if it is on the bottom)
4MM = smd 1.7 x 1.7: IN 0,0 | smd 1 x 0.5: OUT 0,1.9
LSP10 = drill 1.016 pad 2.159 octagon: MP 0,0
B2,54 = smd 2.54 x 2.54: TP 0,0
6410-02 = drill 1.016 long: 1 1.27,0; 2 -1.27,0
C0603 = smd 0.8 x 0.8: 1 -0.75,0; 2 0.75,0
C1206 = smd 1.6 x 1.8: 1 -1.4,0; 2 1.4,0
SOD123 = smd 1.4 x 1.4: A 1.9,0; C -1.9,0
SFH482 = drill 0.813 long: A -1.27,0; K 1.27,0
SOT223 = smd 1.499 x 2.007: 1 -2.261,-3.15; 2 0.025,-3.15; 3 2.311,-3.15 | smd 3.81 x 2.007: 4 0,3.15
SO-08M = smd 0.6 x 2.2: 1 -1.905,-3.33; 2 -0.635,-3.33; 3 0.635,-3.33; 4 1.905,-3.33; 5 1.905,3.33; 6 0.635,3.33; 7 -0.635,3.33; 8 -1.905,3.33
R0805 = smd 1.3 x 1.5: 1 -0.95,0; 2 0.95,0
R2010 = smd 1.8 x 2.7: 1 -2.2,0; 2 2.2,0
L2012C = smd 1 x 1: 1 -1,0; 2 1,0
MICRO3 = smd 0.8 x 0.9: 1 -0.95,-1; 2 0.95,-1; 3 0,1
MM20SS = smd 1.27 x 1.88: 1 -2.794,-1.524; 2 2.794,-1.524; 3 2.794,1.524; 4 -2.794,1.524
R0603 = smd 1 x 1.1: 1 -0.85,0; 2 0.85,0
SJ = smd 1.168 x 1.6: 1 -0.762,0; 2 0.762,0
SOT23 = smd 1 x 1.4: 1 -0.95,-1.1; 2 0.95,-1.1; 3 0,1.1
DFN22 = smd 0.25 x 0.7: 1 -2.5,-1.45; 2 -2,-1.45; 3 -1.5,-1.45; 4 -1,-1.45; 5 -0.5,-1.45; 6 0,-1.45; 7 0.5,-1.45; 8 1,-1.45; 9 1.5,-1.45; 10 2,-1.45; 11 2.5,-1.45; 12 2.5,1.45; 13 2,1.45; 14 1.5,1.45; 15 1,1.45; 16 0.5,1.45; 17 0,1.45; 18 -0.5,1.45; 19 -1,1.45; 20 -1.5,1.45; 21 -2,1.45; 22 -2.5,1.45 | smd 2.2 x 1.65: GND 1.525,0; GND1 -1.5,0 | smd 0.9 x 0.9: P$1 0,0
SOT23-5L = smd 0.55 x 1.2: 1 -0.95,-1.3; 2 0,-1.3; 3 0.95,-1.3; 4 0.95,1.3; 5 -0.95,1.3
CR1216 = smd 2.5 x 5.1: + -7.65,0; P$2 7.65,0 | smd 10.2 x 10.2: GND 0,0
SO08 = smd 0.6 x 2.2: 1 -1.905,-2.6; 2 -0.635,-2.6; 3 0.635,-2.6; 4 1.905,-2.6; 5 1.905,2.6; 6 0.635,2.6; 7 -0.635,2.6; 8 -1.905,2.6
TSSOP16 = smd 0.305 x 0.991: 1 -2.275,-2.918; 2 -1.625,-2.918; 3 -0.975,-2.918; 4 -0.325,-2.918; 5 0.325,-2.918; 6 0.975,-2.918; 7 1.625,-2.918; 8 2.275,-2.918; 9 2.275,2.918; 10 1.625,2.918; 11 0.975,2.918; 12 0.325,2.918; 13 -0.325,2.918; 14 -0.975,2.918; 15 -1.625,2.918; 16 -2.275,2.918
QFN40 = smd 0.85 x 0.28: 1 -3,2.25; 2 -3,1.75; 3 -3,1.25; 4 -3,0.75; 5 -3,0.25; 6 -3,-0.25; 7 -3,-0.75; 8 -3,-1.25; 9 -3,-1.75; 10 -3,-2.25; 21 3,-2.25; 22 3,-1.75; 23 3,-1.25; 24 3,-0.75; 25 3,-0.25; 26 3,0.25; 27 3,0.75; 28 3,1.25; 29 3,1.75; 30 3,2.25 | smd 0.28 x 0.85: 11 -2.25,-3; 12 -1.75,-3; 13 -1.25,-3; 14 -0.75,-3; 15 -0.25,-3; 16 0.25,-3; 17 0.75,-3; 18 1.25,-3; 19 1.75,-3; 20 2.25,-3; 31 2.25,3; 32 1.75,3; 33 1.25,3; 34 0.75,3; 35 0.25,3; 36 -0.25,3; 37 -0.75,3; 38 -1.25,3; 39 -1.75,3; 40 -2.25,3 | smd 2.7 x 3.5: P$2 0,0 | smd 1 x 1.5: P$11 -0.65,0.9; P$12 0.65,0.9; P$13 0.65,-0.9; THERMAL -0.65,-0.9 | drill 0.4 pad 0.406: VIA1 0,1; VIA2 -1,0; VIA3 0,0; VIA4 1,0; VIA5 0,-1
MICRO_USB = smd 0.4 x 1.4: 1_+5V -1.3,2.65; 2_D- -0.65,2.65; 3_D+ 0,2.65; 4_ID 0.65,2.65; 5_0V 1.3,2.65 | smd 4 x 1.9: GND1 0,0 | smd 1.35 x 1.9: GND2 -3.55,0; GND5 3.55,0 | smd 1.15 x 1.45: P$1 -2.4,2.25; P$7 2.4,2.25
20X2 = drill 1: P$1 0,0; P$2 0,2.54; P$3 2.54,0; P$4 2.54,2.54; P$5 5.08,0; P$6 5.08,2.54; P$7 7.62,0; P$8 7.62,2.54; P$9 10.16,0; P$10 10.16,2.54; P$11 12.7,0; P$12 12.7,2.54; P$13 15.24,0; P$14 15.24,2.54; P$15 17.78,0; P$16 17.78,2.54; P$17 20.32,0; P$18 20.32,2.54; P$19 22.86,0; P$20 22.86,2.54; P$21 25.4,0; P$22 25.4,2.54; P$23 27.94,0; P$24 27.94,2.54; P$25 30.48,0; P$26 30.48,2.54; P$27 33.02,0; P$28 33.02,2.54; P$29 35.56,0; P$30 35.56,2.54; P$31 38.1,0; P$32 38.1,2.54; P$33 40.64,0; P$34 40.64,2.54; P$35 43.18,0; P$36 43.18,2.54; P$37 45.72,0; P$38 45.72,2.54; P$39 48.26,0; P$40 48.26,2.54
QFN20-3X3 = smd 0.34 x 0.34: 1 -1.27,1.27; 6 -1.27,-1.27; 11 1.27,-1.27; 16 1.27,1.27 | smd 0.61 x 0.28: 2 -1.35,0.75; 3 -1.35,0.25; 4 -1.35,-0.25; 5 -1.35,-0.75; 12 1.35,-0.75; 13 1.35,-0.25; 14 1.35,0.25; 15 1.35,0.75 | smd 0.28 x 0.61: 7 -0.75,-1.35; 8 -0.25,-1.35; 9 0.25,-1.35; 10 0.75,-1.35; 17 0.75,1.35; 18 0.25,1.35; 19 -0.25,1.35; 20 -0.75,1.35 | smd 1.7 x 1.7: P$1 0,0
DFN-10_2X2 = smd 0.6 x 0.225: 1 -0.9,0.8; 2 -0.9,0.4; 3 -0.9,0; 4 -0.9,-0.4; 5 -0.9,-0.8; 6 0.9,-0.8; 7 0.9,-0.4; 8 0.9,0; 9 0.9,0.4; 10 0.9,0.8
70543-03 = drill 1.016 long: 1 -2.54,0; 2 0,0; 3 2.54,0
FH12-50S-0.5SH = smd 1.3 x 0.3: 1 3.95,27.8; 2 3.95,27.3; 3 3.95,26.8; 4 3.95,26.3; 5 3.95,25.8; 6 3.95,25.3; 7 3.95,24.8; 8 3.95,24.3; 9 3.95,23.8; 10 3.95,23.3; 11 3.95,22.8; 12 3.95,22.3; 13 3.95,21.8; 14 3.95,21.3; 15 3.95,20.8; 16 3.95,20.3; 17 3.95,19.8; 18 3.95,19.3; 19 3.95,18.8; 20 3.95,18.3; 21 3.95,17.8; 22 3.95,17.3; 23 3.95,16.8; 24 3.95,16.3; 25 3.95,15.8; 26 3.95,15.3; 27 3.95,14.8; 28 3.95,14.3; 29 3.95,13.8; 30 3.95,13.3; 31 3.95,12.8; 32 3.95,12.3; 33 3.95,11.8; 34 3.95,11.3; 35 3.95,10.8; 36 3.95,10.3; 37 3.95,9.8; 38 3.95,9.3; 39 3.95,8.8; 40 3.95,8.3; 41 3.95,7.8; 42 3.95,7.3; 43 3.95,6.8; 44 3.95,6.3; 45 3.95,5.8; 46 3.95,5.3; 47 3.95,4.8; 48 3.95,4.3; 49 3.95,3.8; 50 3.95,3.3 | smd 2.4 x 2.4: P$1 0.7,1.2; P$2 0.7,29.9

### Placement (x,y rotation side)
1  6.43,34.63 0 top
2  13.86,34.63 0 top
3  21.27,34.63 0 top
4  28.68,34.63 0 top
5  36.2,34.63 0 top
6  43.51,34.63 0 top
7  50.97,34.63 0 top
8  58.33,34.63 0 top
9  65.73,34.63 0 top
10  73.16,34.63 0 top
11  80.56,34.63 0 top
12  80.56,26.39 0 top
!  65.73,12.71 0 top
(  73.16,19.55 0 top
)  80.56,19.55 0 top
,  73.16,12.71 0 top
.  80.56,12.71 0 top
?  58.33,12.71 0 top
@  65.73,5.87 0 top
A  6.43,19.55 0 top
ANTENNA  43.17,93.97 0 bottom
AUDIO_L  33,94 0 bottom
AUDIO_R  30.5,86 0 bottom
B  36.2,12.71 0 top
BATTERY  83.83,40.45 180 bottom
C  21.27,12.71 0 top
C1  64.1,81.83 270 bottom
C2  36.6,56.02 90 bottom
C3  35.17,56.02 90 bottom
C4  32.33,56.02 90 bottom
C5  77.97,89.4 180 bottom
C6  22.52,71.95 180 bottom
C7  32.62,51.5 270 bottom
C8  39.6,88.12 270 bottom
C9  46.48,51.38 270 bottom
C10  62.65,95.4 0 bottom
C11  70.6,95.5 90 bottom
C12  61.08,92.33 0 bottom
C13  72.62,80.72 180 bottom
C14  65.7,81.83 270 bottom
C15  55.75,85.92 180 bottom
C16  71.55,86.3 270 bottom
C17  77.95,87.9 180 bottom
C18  33.75,56.02 90 bottom
C19  26.9,63.23 90 bottom
C20  22.38,63.42 0 bottom
C21  18.57,53.48 270 bottom
C22  43.65,86.65 0 bottom
C23  48.12,51.38 270 bottom
C24  38.85,95.6 180 bottom
C26  36.52,94.1 180 bottom
C27  36.52,92.67 180 bottom
C28  36.52,91.25 0 bottom
C29  36.52,89.83 0 bottom
C30  33.3,75.12 270 bottom
C31  26.6,76.8 270 bottom
C32  26.6,73.47 270 bottom
D  21.27,19.55 0 top
D1  24.98,64.38 90 bottom
D2  54.5,90.7 270 bottom
D5  29.18,91.6 180 bottom
E  21.27,26.39 0 top
F  28.68,19.55 0 top
FN-RIGHT  76.86,5.87 0 top
G  36.2,19.55 0 top
GND  34.5,86 0 bottom
H  43.51,19.55 0 top
I  58.33,26.39 0 top
IC1  67.47,75.88 180 bottom
IC2  64.3,51.95 270 bottom
J  50.97,19.55 0 top
K  58.33,19.55 0 top
L  65.73,19.55 0 top
L1  24.98,69.12 270 bottom
L2  57.52,91 270 bottom
L3  45.12,93.47 90 bottom
M  50.97,12.71 0 top
N  43.51,12.71 0 top
O  65.73,26.39 0 top
P  73.16,26.39 0 top
Q  6.43,26.39 0 top
Q1  39.2,51.25 180 bottom
Q3  67.42,57.66 0 bottom
Q4  68.92,86.85 180 bottom
Q5  48.8,92.1 270 bottom
R  28.68,26.39 0 top
R1  79.03,52.5 180 bottom
R2  36.1,68.17 90 bottom
R3  79.03,50.48 180 bottom
R4  57.75,51.67 0 bottom
R5  57.75,49.7 0 bottom
R6  38.15,68.17 90 bottom
R7  68.78,95.5 90 bottom
R8  57.25,95.58 0 bottom
R9  72.22,89.1 180 bottom
R10  66.28,95.08 0 bottom
R13  39.48,79.95 0 bottom
R14  39.48,77.9 0 bottom
R15  39.48,75.88 0 bottom
R16  39.48,73.8 180 bottom
R17  39.48,71.75 180 bottom
R18  40.25,61.38 180 bottom
R19  40.25,59.42 180 bottom
R20  40.25,57.48 180 bottom
R21  40.25,55.48 180 bottom
R22  42.67,51.38 90 bottom
R23  44.7,51.38 90 bottom
R24  36.45,51.4 270 bottom
R25  34.38,51.4 270 bottom
R26  68.97,92.53 270 bottom
R27  72.2,91.4 180 bottom
R31  44.4,90.8 0 bottom
R32  44.4,88.85 0 bottom
R33  29.48,77.55 0 bottom
R34  31.57,75.03 90 bottom
R35  18.57,58.17 90 bottom
R36  22.27,65.15 180 bottom
R37  19.7,64.47 90 bottom
R38  19.45,48.88 180 bottom
R39  23.48,87.9 270 bottom
R40  26.35,85.05 180 bottom
R41  24.73,49.73 270 bottom
S  13.86,19.55 0 top
SHIFT-RIGHT  54.62,5.87 0 top
SHILFT-LEFT  10.14,5.87 0 top
SJ1  76,85.35 270 bottom
SPACE1  22.5,5.87 0 top
SPACE2  32.38,5.87 0 top
SPACE3  42.27,5.87 0 top
T  36.2,26.39 0 top
T1  26.6,87.85 90 bottom
T2  60.67,86.5 270 bottom
T5  20.95,56.23 0 bottom
T6  21.68,51.58 90 bottom
T7  24.57,56.08 90 bottom
U  50.97,26.39 0 top
U$1  65.22,90.17 270 bottom
U$2  21.55,68.22 90 bottom
U$3  39.23,82.47 270 bottom
U$4  79.1,66.97 90 bottom
U$5  74.38,53.55 180 bottom
U$6  34.85,62 0 bottom
U$7  79.9,30.62 90 bottom
U$9  76.5,95.8 180 bottom
U$11  77.55,45.55 180 top
U$12  40.35,91.6 0 bottom
U$13  29.07,74.7 90 bottom
V  28.68,12.71 0 top
W  13.86,26.39 0 top
X  13.86,12.71 0 top
X3  84.12,52.17 270 bottom
X5  49,54.2 0 bottom
Y  43.51,26.39 0 top
Z  6.43,12.71 0 top

### Tracks (layer width: path | path; a pad name or v marks a point on that pad's centre or on a via)
+3V3  (via drill 0.5)
  Top 0.406: v37.52,87.62 v45.33,87.62
  Bottom 0.2: R33.2 29.07,76.95 U$13.8 29.07,75.15 29.52,74.7 29.88,74.7 | U$13.1 29.88,74.7 | 29.88,74.7 30.27,74.7 31.45,75.88 R34.2
  Bottom 0.254: C28.1 C29.1 37.17,89.58 | U$12.10 39.6,89.72 39.08,89.72 U$12.11 | 37.27,58.6 37.12,58.75 U$6.1 | X5.3 45.02,81 | 47.55,79 46.98,78.5 45.08,78.5 | 47.55,79 47.6,79.5 X5.6 42.9,79.5 42.9,79.15 43.05,79 | 48.25,80.5 48.25,80 X5.5 42.9,80 | 48.25,80.5 49.12,81 | 49.12,81 49.12,81.5 X5.2 42.9,81.5 | 48.25,80.5 X5.4 42.9,80.5 | 47.55,79 X5.7 43.05,79 | X5.3 42.9,81 | 49.12,81 X5.3 | 43.05,79 43.55,78.5 X5.8
  Bottom 0.305: X5.35 43.92,65 | 45.23,80.5 X5.4 | 45.3,78.5 45.08,78.5 X5.8
  Bottom 0.406: 39.08,89.72 37.27,89.72 C29.1 | 45.42,90.97 R31.1 R32.1 45.33,88.78 v45.33,87.62 | 37.4,89.83 C29.1 | v37.52,87.62 37.52,87.72 37.08,88.17 37.08,89.62 C29.1 | C30.1 R34.2 | C31.1 R33.2 | R2.2 33.17,69.03 29.27,65.12 29.27,64 29.3,56.88 29.3,53.45 30.5,52.25 C7.1 | 34.38,52.3 34.38,52.5 35.17,53.3 C3.1 | 42.9,81.5 42.9,79.5 | C1.1 64.1,83.95 64.17,83.95 | C14.1 65.7,83.95 65.03,83.95
  Bottom 0.61: C7.1 R25.1 34.38,52.3 | C3.1 C2.1 37.4,55.27 37.88,55.75 37.88,58 37.27,58.6 | 43.92,65 43.08,65 39.05,69.03 R6.2 R2.2 36.08,75.88 | R13.2 38.62,81.97 U$3.3 37.52,82.47 v37.52,87.62 | R13.2 R14.2 R15.2 36.08,75.88 | 38.62,79.38 R13.2 | 36.08,75.88 C30.1 | 42.9,81.5 42.9,83.17 44.4,84.67 C22.1 45.33,87.58 v45.33,87.62
  Bottom 1.016: 47.6,79.5 52.05,83.95 64.17,83.95 65.03,83.95 66.55,83.95 67.5,83 IC1.2
+5V  (via drill 0.5, 0.8, 0.9)
  Top 0.254: 77.55,43.05 76.28,43.05 76.28,46.67
  Top 0.406: v46.08,55.52 47.34,56.79 47.99,56.79
  Top 0.61: 76.3,48.95 76.28,48.98 | 50.42,54.35 50.33,54.35
  Top 1.016: U$11.P$4 U$11.P$2
  Top 1.27: v71.83,79.03 v71.83,75.7 71.83,54.35 | 50.42,54.35 71.83,54.35 | 71.83,54.35 72.6,54.35
  Top 1.422: 76.28,46.67 76.28,48.98 76.28,50.67 72.6,54.35 | 50.42,54.35 47.99,56.79 47.62,57.15 v47.62,61 47.62,71.9 40,79.53 v34,79.53
  Bottom 0.254: X5.43 46.12,61 | U$1.13 62.95,88.17 62.95,87.9
  Bottom 0.406: 25.32,70.42 L1.1 | C23.1 C9.1 46.48,53.35 46.08,53.75 v46.08,55.52 | C16.1 72.08,87.05 | X3.3 84.12,49.5 77.64,43.01 U$11.P$2 | R27.2 73.67,91.4 74.6,90.47 74.6,87.16 73.18,85.74 | 71.83,78.1 71.88,78.05 71.88,77.42 v71.83,77.38 | C13.1 71.83,80.67 v71.83,79.03
  Bottom 0.61: U$2.3 20.25,69.67 | 24.65,70.4 L1.1 24.48,70.58 20.25,70.58 | C6.1 20.23,71.95 20.25,70.92 | 46.12,61 v47.62,61 | R39.2 23.48,79.53
  Bottom 0.78: 62.62,85.53 63.12,85.03 67.17,85.03 69.79,82.41 IC1.3 | SJ1.2 74.34,84.59 73.35,85.58 73.18,85.74 72.08,86.8 72.08,87.05
  Bottom 1.27: v71.83,79.03 | v71.83,79.03 | v71.83,79.03 | v71.83,79.03 IC1.3 | SJ1.2 76,79.97 75.05,79.03 v71.83,79.03 | v71.83,75.7
  Bottom 1.422: 20.25,69.67 20.25,70.58 20.25,70.92 20.25,72.92 23.48,76.15 23.48,79.53 v34,79.53 v35.95,79.53 | v71.83,79.03 71.83,78.1 v71.83,77.38 v71.83,75.7
  pour Bottom (isolate 0.254, no thermals): 64.05,88.42 61.4,88.42 61.38,87.45 61.4,85.15 62.75,85.15 63.25,85.62 63.25,86.55
  pour Bottom: 66.65,88.17 71.8,88.17 72.38,87.62 72.38,86.78 70.55,86.72 70.3,87 67.55,87 66.83,87.03 66.65,87.2
  pour Top: 73.78,44.15 73.78,42.2 74.22,41.75 78.33,41.75 78.8,42.25 78.78,44.25 76.7,46.23 75.85,46.23
+15V
  Bottom 0.61: R36.2 C20.1 23.12,62.23 23.2,62.15 | C19.1 D1.C 24.57,62.08 23.27,62.08 23.2,62.15 | 23.2,62.15 23.12,62.08 19.35,62.08 18.57,61.3 R35.2
ACC_INT1  (via drill 0.5)
  Top 0.305: U$11.P$12 63.58,44.28 63.58,47.85 61,50.42 43.4,50.42 28.95,64.88 v28.95,71.8 29.07,71.67
  Bottom 0.254: U$13.3 29.07,71.92 v28.95,71.8
ACC_INT2  (via drill 0.5)
  Top 0.305: U$11.P$16 58.5,44.28 58.5,47.95 56.9,49.55 42.67,49.55 27.77,64.45 v27.77,70.85
  Bottom 0.2: v27.77,70.85 27.77,72.25 28.27,72.75 U$13.5
AUDIO_L
  Bottom 0.406: C26.1 33.1,94.1 AUDIO_L.TP
AUDIO_R
  Bottom 0.406: C27.1 34.85,92.67 32.95,90.78 32.95,88.85 30.5,86.4 AUDIO_R.TP
BASE
  Bottom 0.61: T1.1 R40.1
BAT  (via drill 0.7)
  Top 0.2: v70.92,83.55 v69.88,84.55
  Top 1.27: v69.88,84.55 69.9,84.5 79.83,74.58 79.85,49.05 81.42,47.45 83.55,47.45 85.05,45.92 85.05,40.93 BATTERY.1
  Bottom 0.254: 66.67,87.35 U$1.11
  Bottom 0.813: 66.67,87.35 66.67,86.92 67.12,86.47 68.3,86.47 Q4.3
  Bottom 1.016: v69.88,84.55 68.92,85.55 Q4.3
  Bottom 1.422: v69.88,84.55 v71.95,82.53
BOOST
  Bottom 0.254: U$1.19 62.67,91.17 61.67,92.17 C12.1
CE0
  Bottom 0.305: X5.38 47.65,63.5 50.5,60.65 50.5,49.58 48.35,47.42 48.35,44.27 U$11.P$24
COL0  (via drill 0.6)
  Top 0.254: 13.85,34.65 13.84,34.65 2.IN | 4.IN 28.42,34.63 v28.68,34.65 | 5.IN 35.97,34.63 v36.2,34.65 | 6.IN 43.27,34.63 v43.5,34.62 | 7.IN 50.67,34.63 v50.98,34.62 | 8.IN 58.18,34.63 v58.33,34.62 | 9.IN 65.52,34.63 v65.53,34.65
  Top 0.406: 11.IN
  Top 0.61: 10.IN arc-90 10.IN v73.03,34.62 | 11.IN v80.47,35.02 | 3.IN v21.27,34.56 v21.27,34.55 | 1.IN v6.52,34.63 v6.53,34.62 | v13.88,34.62 13.9,34.62 2.IN
  Bottom 0.254: 28.7,34.65 29.2,34.65 v36.2,34.65 v43.5,34.62 43.27,34.63 6.IN 43.52,34.65 v50.98,34.62 50.7,34.6 v58.33,34.62 58.18,34.63 8.IN 58.34,34.65 65.03,34.65 | 28.7,34.65 4.IN 28.42,34.63 v28.68,34.65 28.7,34.65 | 65.69,34.63 65.52,34.63 v65.53,34.65 65.55,34.63 9.IN | U$7.29 81.65,34.38 81,35.02 v80.47,35.02
  Bottom 0.406: 10.IN 73.16,40.6 73.95,41.4 79.4,41.4 80.47,40.33 v80.47,35.02 | 15.63,34.62 15.71,34.55 v21.27,34.55
  Bottom 0.61: 28.65,34.65 v28.68,34.65 | v28.68,34.65 29.2,34.65 65.03,34.65 v65.53,34.65 73,34.65 | v73.03,34.62 arc90 73,34.65 | 10.IN arc90 73.14,34.65 73,34.65 | v28.68,34.65 27.15,34.62 15.63,34.62 14.44,34.62 v13.88,34.62 v6.53,34.62
COL1  (via drill 0.5, 0.6)
  Top 0.254: v13.82,26.38 W.IN | E.IN 21.3,25.99 21.3,26.05 | 28.55,26.39 R.IN 28.7,26.02 v28.7,26.4 | 28.55,26.39 v28.7,26.4 | T.IN 36.05,26.39 v36.2,26.38 | 21.1,26 v21.27,26.35 | v21.27,26.35 21.3,26.05 | 21.3,26.05 21.35,26 v21.27,26.35 | 28.55,26.39 28.6,26.34 28.6,26 v28.7,26.4 | 12.IN 80.44,26.39 v80.25,26.2 | v85.4,33.62 85.4,26.68 v83.83,25.1
  Top 0.406: Y.IN v43.45,26.38 | U.IN 51,26.36 v50.98,26.4 | I.IN v58.33,26.38 | O.IN v65.75,26.38 65.78,26.35 | P.IN v73.17,26.4
  Top 1.016: Q.IN 6.54,26.39 v6.45,26.38
  Bottom 0.254: v13.82,26.38 W.IN | T.IN 36.05,26.39 v36.2,26.38 | U$7.30 v85.4,33.62
  Bottom 0.406: v73.17,26.4 P.IN | P.IN 73.12,26.38 v65.75,26.38 v58.33,26.38 58.12,26.38 v50.98,26.4 50.9,26.4 v43.45,26.38 v36.2,26.38 28.73,26.38 v28.7,26.4 28.56,26.4 28.51,26.35 v21.27,26.35 13.85,26.35 v13.82,26.38 v6.45,26.38 | P.IN v73.17,26.4 73.5,26.4 74.33,25.57 80.25,25.57 | 80.25,25.57 v80.25,26.2 | v83.83,25.1 83.3,25.57 80.25,25.57
COL2  (via drill 0.6)
  Top 0.254: SHILFT-LEFT.IN 10.28,5.87 arc-90 v10.15,5.85 | v22.5,5.85 22.52,5.85 SPACE1.IN | SPACE2.IN 32.27,5.87 v32.45,5.85 | SPACE3.IN 42.23,5.87 v42.2,5.9 | SHIFT-RIGHT.IN 54.57,5.87 v54.55,5.85 | @.IN 65.67,5.87 v65.65,5.85 | FN-RIGHT.IN 76.72,5.87 v76.7,5.85
  Bottom 0.254: v22.5,5.85 v32.45,5.85 32.43,5.87 SPACE2.IN 32.41,5.9 v42.2,5.9 42.25,5.85 v54.55,5.85 v65.65,5.85 v76.7,5.85 76.72,5.87 FN-RIGHT.IN 76.86,9.3 78.78,11.22 82.21,11.22 85.97,14.99 85.97,31.93 85.03,32.88 U$7.31 82.58,32.88 | 17.52,5.85 17.52,5.9 17.57,5.85
  Bottom 0.61: v10.15,5.85 17.57,5.85 v76.7,5.85
COL3  (via drill 0.6)
  Top 0.254: Z.IN 6.25,12.7 v6.45,12.7 | v13.85,12.7 14.49,12.71 X.IN | C.IN 21.25,12.7 v21.2,12.7 | V.IN 28.66,12.7 v28.6,12.7 | B.IN 36.19,12.7 v36.05,12.7 | N.IN 43.49,12.7 v43.3,12.7 | M.IN 50.95,12.7 v50.7,12.7 | ?.IN v58.2,12.71 v58.2,12.7 | !.IN v65.55,12.71 v65.55,12.7 | ,.IN v73,12.71 v73,12.7 | ..IN v80.4,12.71 v80.4,12.7
  Bottom 0.254: v50.7,12.7 v50.69,12.71 50.15,12.71 | 50.15,12.71 N.IN 43.49,12.7 v43.3,12.7 v36.05,12.7 v36.04,12.71 V.IN 28.66,12.7 v28.6,12.7 v28.59,12.71 C.IN 21.25,12.7 v21.2,12.7 v13.85,12.7 | v58.2,12.7 50.15,12.7 50.15,12.71 | v65.55,12.7 v73,12.7 v80.4,12.7 | ..IN v80.41,12.71 v80.4,12.7 | 10.12,12.7 10.53,12.7 | v80.4,12.7 85.5,17.8 85.5,31.73 84.85,32.38 U$7.32
  Bottom 0.61: v65.55,12.7 v58.2,12.7 | v6.45,12.7 10.53,12.7 v80.4,12.7
COL4  (via drill 0.6)
  Top 0.254: ).IN v80.4,19.55 | v73.05,19.55 (.IN | L.IN v65.85,19.55 | K.IN v58.2,19.55 | J.IN v51.1,19.55 | H.IN v43.65,19.55 | G.IN v36.35,19.55 | F.IN v28.8,19.55 | D.IN v21.45,19.55 | S.IN v14.05,19.55 | A.IN v6.35,19.55
  Bottom 0.254: v14.05,19.55 v21.45,19.55 v28.8,19.55 v36.35,19.55 v43.65,19.55 v51.1,19.55 v58.2,19.55 v65.85,19.55 v73.05,19.55 v80.4,19.55 ).IN | 80.65,19.55 ).IN | ).IN 85.03,24.01 85.03,31.48 84.62,31.88 U$7.33
  Bottom 0.61: v6.35,19.55 v80.4,19.55
COLLECTOR
  Bottom 0.406: D5.K 30.45,90.59 T1.3
D/C  (via drill 0.5)
  Top 0.305: U$11.P$22 50.88,44.28 50.88,46.5 v50,47.38
  Bottom 0.305: X5.37 47.95,64 51.08,60.88 51.08,48.45 v50,47.38
DE
  Bottom 0.254: X5.13 42.92,76 42.48,75.55 42.48,73.28 40.95,71.75
  Bottom 0.305: 40.95,71.75 R17.2
DISPLAY_RESET
  Bottom 0.305: X5.9 42.83,78 40.88,79.95 R13.1
  Bottom 0.406: U$3.2 R13.1
FB
  Bottom 0.406: R36.1 21.43,67.97 21.18,68.22 U$2.2
  Bottom 0.61: C20.2 21.62,64.95 R36.1 19.82,65.15 R37.2
FM_RST
  Bottom 0.254: R31.2 43.92,90.85 U$12.5
GND  (via drill 0.5, 0.6)
  Bottom 0.2: 28.68,76.28 U$13.7 28.68,74.9 28.27,74.9 U$13.6 28.27,76.3
  Bottom 0.254: 45,66.5 46.73,66.5 46.9,66.67 46.9,67 | X5.50 45.05,54.5 | X5.1 45.05,83.97 | U$1.16 64.95,89.67 | 64.95,89.67 65.22,89.67 v65.22,89.12 U$1.GND | U$1.1 64.95,92.67 64.95,89.67 | U$12.3 40.35,91.85 U$12.P$1 40.35,91.35 U$12.13 38.23,91.35 | U$12.12 38.5,90.85 arc90 38,90.35 | 38.17,91.85 U$12.14 39.62,91.85 | U$7.4 80.65,30.2 U$7.VIA3
  Bottom 0.305: 43.3,75 43.3,75.5 X5.14 46.95,75.5 46.9,75 | 43.3,75 43.3,74.5 | 43.3,74.5 43.3,74 | 43.3,74 43.3,73.5 | 43.3,73.5 43.3,73 | 43.3,73 43.3,72.5 | 43.3,72.5 43.3,72 | 43.3,72 42.8,71.5 | 42.8,71.5 42.8,71 | 42.8,71 42.8,70.5 | 42.8,69.5 42.8,69 | 42.8,69 42.8,68.5 | 42.8,68.5 42.8,68 | 42.8,68 42.8,67.5 | 42.8,67.5 42.8,67 | 42.8,67 43.3,66.5 45,66.5 X5.32 | 42.8,67 X5.31 46.9,67 46.9,67.5 | 42.8,67.5 X5.30 46.9,67.5 | 42.8,68 X5.29 46.9,68 | 42.8,68.5 X5.28 46.9,68.5 | 42.8,69 X5.27 46.9,69 | 42.8,69.5 X5.26 46.9,69.5 | 42.8,70.5 X5.24 46.9,70.5 | 42.8,70.5 42.8,70 | 42.8,70 X5.25 46.9,70 | 42.8,70 42.8,69.5 | 42.8,71 X5.23 46.9,71 | 42.8,71.5 X5.22 46.9,71.5 | 43.3,72 X5.21 46.9,72 | 43.3,72.5 X5.20 46.9,72.5 | 43.3,73 X5.19 46.9,73 | 43.3,73.5 X5.18 46.9,73.5 | 43.3,74 X5.17 46.9,74 | 43.3,75 X5.15 46.9,75 | 43.3,74.5 X5.16 46.9,74.5 | 46.9,75 46.9,74.5 | 46.9,74.5 46.9,74 | 46.9,74 46.9,73.5 | 46.9,73.5 46.9,73 | 46.9,73 46.9,72.5 | 46.9,72.5 46.9,72 | 46.9,72 46.9,71.5 | 46.9,71.5 46.9,71 | 46.9,71 46.9,70.5 | 46.9,70.5 46.9,70 | 46.9,70 46.9,69.5 | 46.9,69.5 46.9,69 | 46.9,69 46.9,68.5 | 46.9,68.5 46.9,68 | 46.9,68 46.9,67.5
  Bottom 0.406: U$7.VIA5 79.45,30.3 U$7.THERMAL | 20.32,52.55 20.55,52.55 T6.2 20,53.1 T5.2
  Bottom 0.61: 20.32,52.55 20.95,52.55 21.8,53.4 27.3,53.4
  other vias: 65.22,91.22 65.22,88.05 65.22,92.33 77.9,39.42 60.23,48.42 77.12,23.07 76.95,16.05 70.15,8.45 69.42,15.72 69.55,23.45 70.65,3.38 40.83,94.35 39.67,65.88 33.52,67.47 33.23,72.25 44.6,55.62 51,63.5 52.58,95.97 52.58,93.92 52.58,91.88 52.58,89.83 52.58,87.8 52.58,85.75 18.65,47.1 20.15,47.1 21.65,47.1 23.12,47.1 27.5,48.52 27.5,49.95 27.5,52 27.5,53.48 27.5,54.98 27.5,56.5 27.5,57.98 26.48,59 25,59 23.5,59 22.02,59 20.52,59 25.88,47.1 73.38,87.5 72.8,84.08 74.08,82.85 30.7,96.22 35.83,96.3 29.55,83.08 18.95,74.53 64.8,61.45 67.3,61.48 69.75,61.5 74,61.23 83.83,60.7 77.92,54.62 50.4,68.62 41.33,69.72 35.83,77.38 35.83,81.75 50.88,86.78 71.75,93.3 77.67,91.08 80.12,91.15 78.55,85.55 64.17,72.7 64.17,70.5 66.15,70.53 68.12,70.5 70.03,70.5 73.9,77.03 73.95,74.9 73.95,72.65 65.78,75.85 69.15,75.7 50.08,78.38 43.77,48.02 32.7,48.95 85.28,35.95 78.2,48.45 78.42,79.53 66.95,96.8 64.6,96.83 62.35,96.83 60.12,96.83 54.65,96.78 48.83,86.75 46.75,86.75 34.33,88.6 23.07,90.97
  pour Bottom (rank 6): 17.5,42.5 1.5,42.5 arc90 0,41 0,5 arc90 5,0 82,0 arc90 87,5 87,94 arc90 83,98 23,98 arc90 21.5,96.5 21.5,77.02 arc-90 20.48,76 18.5,76 arc90 17.5,75
  pour Top (rank 6): 17.5,42.5 1.5,42.5 arc90 0,41 0,5 arc90 5,0 82,0 arc90 87,5 87,94 arc90 83,98 23,98 arc90 21.5,96.5 21.5,77 arc-90 20.5,76 18.5,76 arc90 17.5,75
H_SYNC
  Bottom 0.305: X5.11 41.45,77 R15.1
HVOUT
  Bottom 0.254: U$1.18 62.42,90.67 61.92,91.17 61.88,91.17
  pour Bottom (rank 2): 64.12,90.9 63.2,90.92 62.2,91.92 59.73,91.92 58.05,91.42 56.7,91.42 55.67,91.4 55.67,85.15 61.1,85.15 61.12,87.88 61.08,89.85 64.17,90.1 64.17,90.62
HVPR  (via drill 0.5)
  Top 0.406: v60.1,88.22 60.1,86.88 61.88,85.12 62.35,84.65 66,84.65 v71.67,90.33
  Bottom 0.254: U$1.7 69.8,89.67 70.42,90.3 71.18,90.31 | 71.18,90.31 v71.67,90.33 | R27.1 71.35,90.49 71.18,90.31
  Bottom 0.406: v60.1,88.22 60.52,88.22 61.3,87.45 T2.1
ID_SC
  Bottom 0.406: U$11.P$28 44.53,41.82 45.85,40.5 59.98,40.5 61.02,41.55 61.02,46.67 63.27,48.92 63.27,50.45 62.4,51.33 61.55,51.33 IC2.6 58.6,51.31 R4.1
ID_SD
  Bottom 0.406: 60.95,50.02 IC2.5 | 61.2,50.05 IC2.5 | R5.1 58.58,50.05 | 58.65,49.98 R5.1 | IC2.5 58.59,50.05 | 58.59,50.05 R5.1 | 58.59,50.05 58.67,49.97 | U$11.P$27 45.8,44.28 45.8,41.85 46.27,41.38 58,41.38 58.5,41.88 58.5,49.95 R5.1
IN  (via drill 0.5, 0.7)
  Top 1.016: v62.65,89.4 62.65,87 63.48,86.17 v65.17,86.17 70.83,91.83 74.33,91.83 76,90.15 v76,89.38
  Top 1.27: v76,89.38 v76,87.9
  Bottom 0.254: 63.77,87.55 U$1.12 | U$1.15 62.9,89.17 v62.65,89.4
  Bottom 0.406: 63.77,87.55 63.77,86.65 v64.08,86.17 | 76,86.6 SJ1.1 | C5.1 77.05,89.45 76.97,89.38 v76,89.38 | C17.1 v76,87.9 | U$9.1_+5V 75.2,92.17
  Bottom 0.61: 75.2,92.17 75.2,91.9
  Bottom 1.016: v76,87.9 76,86.6 | 75.2,91.9 76,91.1 v76,89.38
  Bottom 1.27: v76,89.38 v76,87.9
  pour Bottom (no thermals): 63.7,87.1 63.67,85.7 65.53,85.7 65.53,86.53 64.1,86.85
  pour Bottom: 62,88.83 62.17,88.65 63.95,88.65 63.95,90.17 62.35,90.15 62,89.75
INT_KB  (via drill 0.5)
  Top 0.254: v32.62,29.12 32.62,35.27 31.83,36.07 U$11.P$38
  Bottom 0.254: U$7.12 32.88,28.88 v32.62,29.12
INT_RTC
  Bottom 0.406: U$11.P$7 73.74,49.36 U$5.7
INT_TOUCH  (via drill 0.5)
  Top 0.406: U$11.P$31 39.45,49.2 34.9,53.75 v33.67,53.75
  Bottom 0.305: U$6.10 33.23,64.38 30.52,61.67 30.52,54.38 31.15,53.75 v33.67,53.75
IR_RX
  Bottom 0.305: U$11.P$11 66.22,44.17 77.9,44.17 81.28,47.55 81.28,52.98 83.04,54.72 X3.1
IR_TX  (via drill 0.5)
  Top 0.406: v27.2,83.72 25,81.5 25,65.53 31.3,59.23 31.3,53.02 34.37,49.95 U$11.P$35
  Bottom 0.406: R40.2 v27.2,83.72
LEDK1
  Bottom 0.254: X5.44 41.98,60.5 R18.2
LEDK2
  Bottom 0.254: X5.45 41.73,60 R19.2
LEDK3
  Bottom 0.254: X5.46 43.45,59.5 41.35,57.45 R20.2
LEDK4
  Bottom 0.254: X5.47 43.65,59 42.2,57.55 42.2,56.52 R21.2
LEDK5
  Bottom 0.254: X5.48 43.83,58.5 42.67,57.35 R22.2
LEDK6
  Bottom 0.254: X5.49 43.98,58 43.15,57.17 43.15,53.77 R23.2
LX
  Bottom 0.406: D1.A 24.98,67.33 L1.2
  Bottom 0.61: U$2.5 24.93,67.28 24.98,67.33
MISO  (via drill 0.5)
  Top 0.305: v54.52,47.48 52.62,47.48 52.15,47 U$11.P$21
  Bottom 0.305: X5.33 51.05,66 53.42,63.62 53.42,48.45 v54.52,47.48
MOSI
  Bottom 0.305: X5.34 50.83,65.5 52.92,63.4 52.92,47.31 U$11.P$19
N$1
  Bottom 0.406: Q3.4 72.55,59.18 73.74,57.98 U$5.2
N$2
  Bottom 0.406: Q3.1 70.24,56.15 U$5.1
N$3
  Bottom 0.254: U$1.9 70.92,88.67 R9.1
N$4
  Bottom 0.254: U$1.3 67.33,91.67 67.47,91.83 67.45,94.55 R10.1 67.35,94.92
N$5  (via drill 0.5)
  Top 0.406: v60.12,89.83 59.17,90.7 v59.17,95.4
  Bottom 0.254: U$1.14 62.75,88.67 62.48,88.4 61.55,88.4 v60.12,89.83
  Bottom 0.406: v59.17,95.4 58.1,95.4 R8.1
N$6
  Bottom 0.254: U$1.4 67.75,91.17 67.97,91.4 67.97,94.08 68.62,94.75 R7.1
N$7  (via drill 0.5)
  Top 0.406: v61.42,90.47 61.42,94.78 v60.8,95.4
  Bottom 0.254: U$1.17 61.77,90.17 v61.42,90.47
  Bottom 0.406: v60.8,95.4 C10.2
N$8
  Bottom 0.406: R7.2 70.5,96.35 C11.2
N$9
  Bottom 0.254: U$1.22 63.35,92.67 63.35,92.17 U$1.21
N$12
  Bottom 0.61: R18.1 R19.1 R20.1 R21.1 39.4,54.02 40.15,53.27 Q1.2 41.88,50.52 R22.1 R23.1 44.73,50.55
N$15  (via drill 0.5)
  Top 0.406: v38.65,88.85 40.42,90.62 48.6,90.62 v50.42,92.45
  Bottom 0.254: U$12.9 40.1,88.83 C8.1
  Bottom 0.406: v50.42,92.45 50.42,94.39 Q5.1 | v38.65,88.85 38.67,88.88 C8.1
N$16
  Bottom 0.61: T7.1 T5.1
N$19
  Bottom 0.254: U$12.17 C24.2
  Bottom 0.305: Q5.4 47.28,94.75
  Bottom 0.406: C24.2 39.9,95.9 46.27,95.9 Q5.4
N$20
  Bottom 0.61: R24.1 Q1.1
N$21
  Bottom 0.254: R26.1 69.33,93.38 70.08,92.62 70.08,90.9 69.35,90.17 U$1.6
N$23
  Bottom 0.254: C26.2 38.51,92.87 U$12.16
N$25
  Bottom 0.254: C27.2 37.6,92.35 U$12.15
N$26
  Bottom 0.254: L3.2 45.02,94.3 43.27,94.3 | 43.27,94.3 ANTENNA.MP | 43.27,94.3 43.27,92.15 42.48,91.35 U$12.4
N$27
  Bottom 0.254: U$1.5 67.97,90.67 R26.2
N$28
  Bottom 0.61: T7.2 21.25,57.02 T5.3 R35.1 C21.1
N$29
  Bottom 0.254: U$12.6 43.1,88.85 R32.2
N$30
  Bottom 0.406: R39.1 26.32,91.6 D5.A
N$31
  Bottom 0.254: U$13.4 28.68,74.33 28.5,74.5 26.98,74.5 C32.1
N$32
  Bottom 0.61: C21.2 18.6,52.7 18.6,50.62 | 18.6,50.62 R38.1 | T6.1 18.6,50.62
N$33
  Bottom 0.254: U$1.10 67.72,88.17 Q4.1
P_CLK
  Bottom 0.254: X5.12 42.42,76.5 41.62,75.7 41.62,74.53 40.9,73.8
  Bottom 0.305: 40.9,73.8 R16.2
PWM
  Bottom 0.61: R25.2 R24.2 36.91,50.09 U$11.P$33
RANDOM
  Bottom 0.406: U$11.P$37 31.83,47.77 28.65,50.95 25.1,50.95 R41.1 23.77,50.58 T6.3
RANDOM_POWER  (via drill 0.5)
  Top 0.406: U$11.P$40 28.24,43.01 27.23,44.02 27.23,46.02 28.93,47.73 28.93,58.7 27.1,60.52 20.93,60.52 18.73,62.73 v18.73,67.28
  Bottom 0.406: 29.04,43.01 U$11.P$40 28.24,43.01 27.23,44.02 27.23,47.33 25.68,48.88 R41.2 | U$2.1 v18.73,67.28
  Bottom 0.61: R38.2 R41.2
ROW0  (via drill 0.5)
  Top 0.254: 7.85,11.35 arc90 8.4,11.9 8.4,12.65 arc90 Z.OUT Z.OUT arc-90 6.4,14.64 | 9.2,7.75 10.12,7.75 SHILFT-LEFT.OUT | 1.OUT 1.OUT arc90 4.5,34.6 arc90 6.45,32.65 6.58,32.77 7.1,32.77 7.4,33.08 v10.07,33.08 | 6.45,28.3 arc-90 Q.OUT 6.34,28.29 arc90 4.45,26.4 4.45,26.3 arc90 6.4,24.35 | 6.4,21.48 arc90 A.OUT 6.3,21.45 arc90 4.4,19.55 4.4,19.4 arc90 6.4,17.4
  Top 0.61: 6.45,32.65 6.43,32.63 Q.OUT | 6.4,24.35 6.43,24.32 A.OUT | 6.4,17.4 6.43,17.36 Z.OUT | 9.2,7.75 7.85,9.1 7.85,11.35
  Bottom 0.254: U$7.15 12.78,30.38 v10.07,33.08
ROW1  (via drill 0.5)
  Top 0.254: 2.OUT 13.73,36.53 arc90 11.85,34.65 11.85,34.55 arc90 13.85,32.55 | W.OUT arc90 W.OUT 13.74,28.29 arc90 11.85,26.4 11.85,26.35 arc90 13.9,24.3 | 13.9,21.5 arc-90 S.OUT 13.75,21.45 arc90 11.85,19.55 11.85,19.45 arc90 13.85,17.45 | X.OUT arc90 X.OUT | v17.38,33 14.9,33 14.57,32.67 13.98,32.67 13.86,32.55
  Top 0.61: 13.9,24.3 13.86,24.25 S.OUT | 13.85,32.55 13.86,32.55 W.OUT | 13.85,17.45 13.86,17.45 X.OUT
  Bottom 0.254: U$7.16 19.5,30.88 v17.38,33
ROW2  (via drill 0.5)
  Top 0.254: 21.25,10.65 arc90 23.2,12.6 23.2,12.75 arc90 21.34,14.61 C.OUT arc90 21.3,14.64 | 21.3,17.55 arc-90 19.3,19.55 arc-90 21.2,21.45 D.OUT arc-90 21.25,21.46 | 21.25,24.3 arc-90 19.25,26.3 19.25,26.4 arc-90 21.14,28.29 E.OUT arc-90 21.25,28.3 | 3.OUT 21.18,36.53 arc90 19.3,34.65 19.3,34.5 arc90 21.25,32.55 | v24.88,33.17 22.35,33.17 22.05,32.88 21.61,32.88 21.27,32.53
  Top 0.61: 21.25,32.55 21.27,32.53 E.OUT | 21.25,24.3 21.27,24.29 D.OUT | 21.3,17.55 21.27,17.52 C.OUT | SPACE1.OUT 21.25,9.02 21.25,10.65
  Bottom 0.254: U$7.17 26.68,31.38 v24.88,33.17
ROW3  (via drill 0.5)
  Top 0.254: 4.OUT 28.53,36.53 arc90 26.65,34.65 arc90 28.7,32.6 28.7,32.35 29.15,32.8 29.52,32.8 30.07,33.35 v31.3,33.33 | 28.7,28.32 arc-90 R.OUT 28.59,28.29 arc90 26.7,26.4 26.7,26.2 arc90 28.65,24.25 | 28.65,21.48 arc90 F.OUT 28.6,21.45 arc90 26.7,19.55 26.7,19.45 arc90 28.65,17.5 | 28.65,14.63 arc90 V.OUT 28.79,14.61 arc-90 30.7,12.7 30.7,12.05 arc-90 30,11.35 | 31.55,7.75 32.37,7.75 SPACE2.OUT
  Top 0.61: 28.7,32.35 28.68,32.33 R.OUT | 28.65,17.5 28.68,17.48 V.OUT | 28.65,24.25 28.68,24.23 F.OUT | 31.55,7.75 30,9.3 30,11.35
  Bottom 0.254: v31.3,33.33 32.77,31.85 U$7.18
ROW4  (via drill 0.5)
  Top 0.254: 36.2,17.5 arc-90 34.25,19.45 34.25,19.55 arc-90 36.15,21.45 G.OUT arc90 G.OUT | B.OUT arc-90 B.OUT | 36.2,24.35 arc-90 34.3,26.25 34.3,26.4 arc-90 T.OUT T.OUT arc90 T.OUT | 36.17,36.55 5.OUT 36.03,36.53 arc90 34.15,34.65 34.15,34.55 arc90 36.2,32.5 36.5,32.8 37.12,32.8 37.9,33.58 v39.9,33.58
  Top 0.61: 36.2,32.5 36.2,32.49 T.OUT | 36.2,24.35 36.2,24.34 G.OUT | 36.2,17.5 B.OUT
  Bottom 0.254: v39.9,33.58 41.1,32.38 U$7.19
ROW5  (via drill 0.5)
  Top 0.254: Y.OUT arc90 Y.OUT 43.49,28.29 arc90 41.6,26.4 41.6,26.3 arc90 43.5,24.4 | H.OUT arc90 H.OUT 43.4,21.45 arc90 41.45,19.5 41.45,19.45 arc90 43.5,17.4 | N.OUT arc90 N.OUT 43.41,14.61 arc90 41.5,12.7 41.5,12.2 arc90 42.75,10.95 | 6.OUT 43.48,36.53 arc90 41.55,34.6 41.55,34.45 arc90 43.5,32.5 43.6,32.6 44.08,32.6 45.12,33.65 v47.27,33.65
  Top 0.61: 43.5,32.5 43.51,32.49 Y.OUT | 43.5,24.4 43.51,24.39 H.OUT | 43.5,17.4 43.51,17.39 N.OUT | SPACE3.OUT 42.27,10.46 42.75,10.95
  Bottom 0.254: U$7.20 48.05,32.88 v47.27,33.65
ROW6  (via drill 0.5)
  Top 0.254: 52.35,11.25 arc90 53,11.9 53,12.7 arc90 51.09,14.61 M.OUT arc-90 50.95,14.62 | 53.65,7.75 54.6,7.75 SHIFT-RIGHT.OUT | 50.95,17.5 arc-90 48.9,19.55 48.9,19.6 arc-90 50.75,21.45 J.OUT arc-90 50.95,21.46 | 50.95,24.4 arc-90 49,26.35 49,26.4 arc-90 50.89,28.29 U.OUT arc90 51,28.32 | 51.45,32.95 51,32.5 arc-90 49,34.5 49,34.6 arc-90 50.93,36.53 7.OUT 50.95,36.55
  Top 0.406: 7.OUT 54.26,39.83 74.35,39.83 v74.58,40.05
  Top 0.61: 51,32.5 50.97,32.47 U.OUT | 50.95,24.4 50.97,24.39 J.OUT | 50.95,17.5 50.97,17.48 M.OUT | 53.65,7.75 52.35,9.05 52.35,11.25
  Bottom 0.254: v74.58,40.05 74.58,37.3 77.65,34.23 U$7.21
ROW7  (via drill 0.5)
  Top 0.254: 8.OUT 58.23,36.53 arc90 56.3,34.6 56.3,34.5 arc90 58.3,32.5 58.8,32.5 59.4,33.1 | 58.3,28.32 arc90 I.OUT 58.19,28.29 arc90 56.3,26.4 arc90 58.35,24.35 | 58.35,21.48 arc-90 K.OUT 58.3,21.45 arc90 56.4,19.55 56.4,19.35 arc90 58.3,17.45 | 58.3,14.63 arc90 ?.OUT
  Top 0.305: 8.OUT 60.62,38.83 75.28,38.83 v76.15,39.7
  Top 0.61: 58.3,32.5 58.33,32.48 I.OUT | 58.35,24.35 58.33,24.32 K.OUT | 58.3,14.63 58.3,17.45
  Bottom 0.254: v76.15,39.7 76.03,39.7 75.1,38.77 75.1,37.6 78.15,34.55 U$7.22
ROW8  (via drill 0.5)
  Top 0.254: 65.75,10.65 arc-90 63.7,12.7 arc-90 65.61,14.61 !.OUT arc-90 65.7,14.64 | 65.75,7.79 arc-90 @.OUT | 65.58,36.67 9.OUT
  Top 0.305: 9.OUT 67.06,37.85 v76.05,37.85
  Top 0.61: 65.75,7.79 65.75,10.65 | 65.7,14.64 65.7,17.57 arc-90 63.8,19.48 63.8,19.6 arc-90 65.65,21.45 L.OUT arc90 65.75,21.46 65.75,24.35 arc-90 63.75,26.35 63.75,26.55 arc-90 65.49,28.29 O.OUT arc-90 O.OUT 65.72,32.65 arc-90 63.77,34.6 63.77,34.67 arc-90 65.63,36.53 9.OUT arc-90 9.OUT
  Bottom 0.254: v76.05,37.85 76.05,37.35 78.65,34.75 U$7.23
ROW9  (via drill 0.5)
  Top 0.254: 73.2,17.5 arc-90 71.2,19.5 71.2,19.55 arc-90 73.1,21.45 (.OUT arc-90 (.OUT | 73.2,14.65 arc-90 ,.OUT 73.34,14.61 arc-90 75.2,12.75 75.2,12.05 arc-90 74.45,11.3 | 76,7.8 76.83,7.8 FN-RIGHT.OUT | 73.16,24.34 73.15,24.35 arc-90 71.15,26.35 71.15,26.4 arc-90 73.04,28.29 P.OUT | 73.17,32.62 arc-90 71.25,34.55 71.25,34.7 arc-90 73.08,36.53 10.OUT 73.92,36.53 74.58,35.85 76.33,35.85 v77.65,37.17
  Top 0.406: P.OUT arc90 73.17,28.31 73.17,32.62
  Top 0.61: 73.16,24.34 (.OUT | 73.2,17.5 73.16,17.45 ,.OUT | 76,7.8 74.45,9.35 74.45,11.3
  Bottom 0.254: v77.65,37.17 77.65,37.1 79.15,35.6 U$7.24
ROW10  (via drill 0.5)
  Top 0.254: 80.56,17.56 80.53,17.6 arc-90 78.6,19.52 78.6,19.65 arc-90 80.4,21.45 ).OUT | 80.58,24.38 arc-90 78.65,26.3 78.65,26.43 arc-90 80.52,28.29 12.OUT 81.88,29.6 81.88,31.65 80.8,32.73 | 80.8,32.73 80.55,32.73 arc90 82.45,34.62 82.45,34.75 arc90 80.67,36.53 11.OUT 79.1,37.99 v79.1,38.42 | 80.8,32.73 81.17,32.73
  Top 0.406: 12.OUT arc-90 80.55,28.3
  Top 0.61: ..OUT 80.56,17.56 | ).OUT arc90 80.58,21.46 80.58,24.38
  Bottom 0.254: U$7.25 79.65,37.88 v79.1,38.42
SCK
  Bottom 0.305: X5.36 48.38,64.5 51.7,61.17 51.7,47.64 U$11.P$23
SCL_3V3  (via drill 0.5, 0.6)
  Top 0.406: v62.17,36.92 62.17,27.82 v62,27.65 | v63.83,41.27 70.08,41.27 71.2,42.4 71.2,44.28 U$11.P$5 72.47,48.8 69.88,51.4 44.08,51.4 v33.4,62.08 30.2,65.28 v30.2,72.67 30.2,80.9 35.52,86.22 v41.3,86.22
  Bottom 0.2: U$13.2 29.48,73.28 29.75,73 30.12,73 | 30.12,73 30.57,73 31.57,74 R34.1 | v30.2,72.67 30.2,72.92 30.12,73
  Bottom 0.254: 72.45,45.57 U$11.P$5 | U$7.11 62.73,28.38 v62,27.65 | U$12.7 41.1,86.42 v41.3,86.22 | R6.1 37.23,66.4 35.38,66.4 34.52,65.55 U$6.12 34.52,64.28 34.75,64.05 34.75,63.42 v33.4,62.08
  Bottom 0.406: v63.83,41.27 62.17,39.62 v62.17,36.92 | R1.1 77.85,52.83 75.4,52.83 75,52.42 U$5.6 75.01,48.09 U$11.P$5
SDA_3V3  (via drill 0.5)
  Top 0.406: 72.17,41.1 v71.95,41.1 73.08,41.1 73.75,41.77 73.75,44.29 U$11.P$3 | v69.42,36.33 69.47,36.27 v69.47,27.38 | 74.95,45.6 U$11.P$3 | U$11.P$3 74.3,46.26 74.3,49.92 71.55,52.67 44.98,52.67 v33.88,63.77 31.85,65.8 v31.85,77.7 31.85,79.92 36.9,84.97 v40.6,84.97
  Bottom 0.2: U$13.10 29.88,76.92 30.05,77.1 R33.1
  Bottom 0.254: v40.6,84.97 U$12.8 | R2.1 35.27,67.33 33.88,65.92 U$6.11 v33.88,63.77
  Bottom 0.305: U$7.10 69.72,27.62 v69.47,27.38
  Bottom 0.406: v71.95,41.1 69.42,38.58 v69.42,36.33 | 76.28,50.48 R3.1 | 76.28,50.48 76.28,46.82 U$11.P$3 | U$5.5 76.28,50.48 | R33.1 30.65,77.7 v31.85,77.7
SW
  Bottom 0.254: U$1.20 63.25,91.67 62.73,92.12
  pour Bottom (isolate 0.254): 64.03,91.2 63.1,91.22 62.25,92.08 59.83,92.1 59.55,91.75 59.25,91.35 54.1,91.35 54.1,94 56.25,94 62.4,94.03 62.95,93.5 62.95,92.58
TOUCH_X+  (via drill 0.5)
  Top 0.406: v38.2,61.5 38.2,63.4 v38.95,64.17
  Bottom 0.254: X5.39 43.77,63 42.83,63.95 39.17,63.95 v38.95,64.17
  Bottom 0.305: C2.2 36.48,56.9 U$6.2 36.48,61.1 36.88,61.5 v38.2,61.5
TOUCH_X-
  Bottom 0.254: X5.41 43.2,62 42.35,62.85 36.38,62.85 35.17,61.65 U$6.4 35.17,58.2 C18.2
TOUCH_Y+
  Bottom 0.254: X5.42 42.85,61.5 42,62.35 36.6,62.35 35.83,61.58 U$6.3 35.83,57.42 C3.2
TOUCH_Y-
  Bottom 0.254: X5.40 43.5,62.5 42.65,63.35 36.2,63.35 34.52,61.67 U$6.5 34.52,58.35 33.8,57.62 33.17,57.62 C4.2
V+
  Bottom 0.406: U$11.P$17 57.23,49.67 R5.2 R4.2 56.9,53.08 57.68,53.85 IC2.8 63.07,53.85 64.85,52.08 64.85,48.9 65.33,48.42 71.2,48.42 72.47,49.7 U$5.8
V_SYNC
  Bottom 0.305: X5.10 40.73,77.5 R14.1
VBAT+
  Bottom 0.305: U$5.3 75.01,58.13 75.35,58.48 78.4,58.48 U$4.+
VCC  (via drill 0.6)
  Top 0.406: U$11.P$1 77.83,45.55 79.5,43.88 79.5,40.15 83.97,35.67 83.97,29.18 v84.08,29.07
  Bottom 0.254: U$7.38 83.78,29.38 v84.08,29.07 83.88,28.88 U$7.39
  Bottom 0.406: R1.2 R3.2 79.88,47.88 U$11.P$1